# EAGLE schematic CMOS_Synthesizer_V2_REVB (EAGLE 9.6.2)

## Sheet 1 of 12: Gated Schmitt trigger Oscillator 1-4 (CD4093)
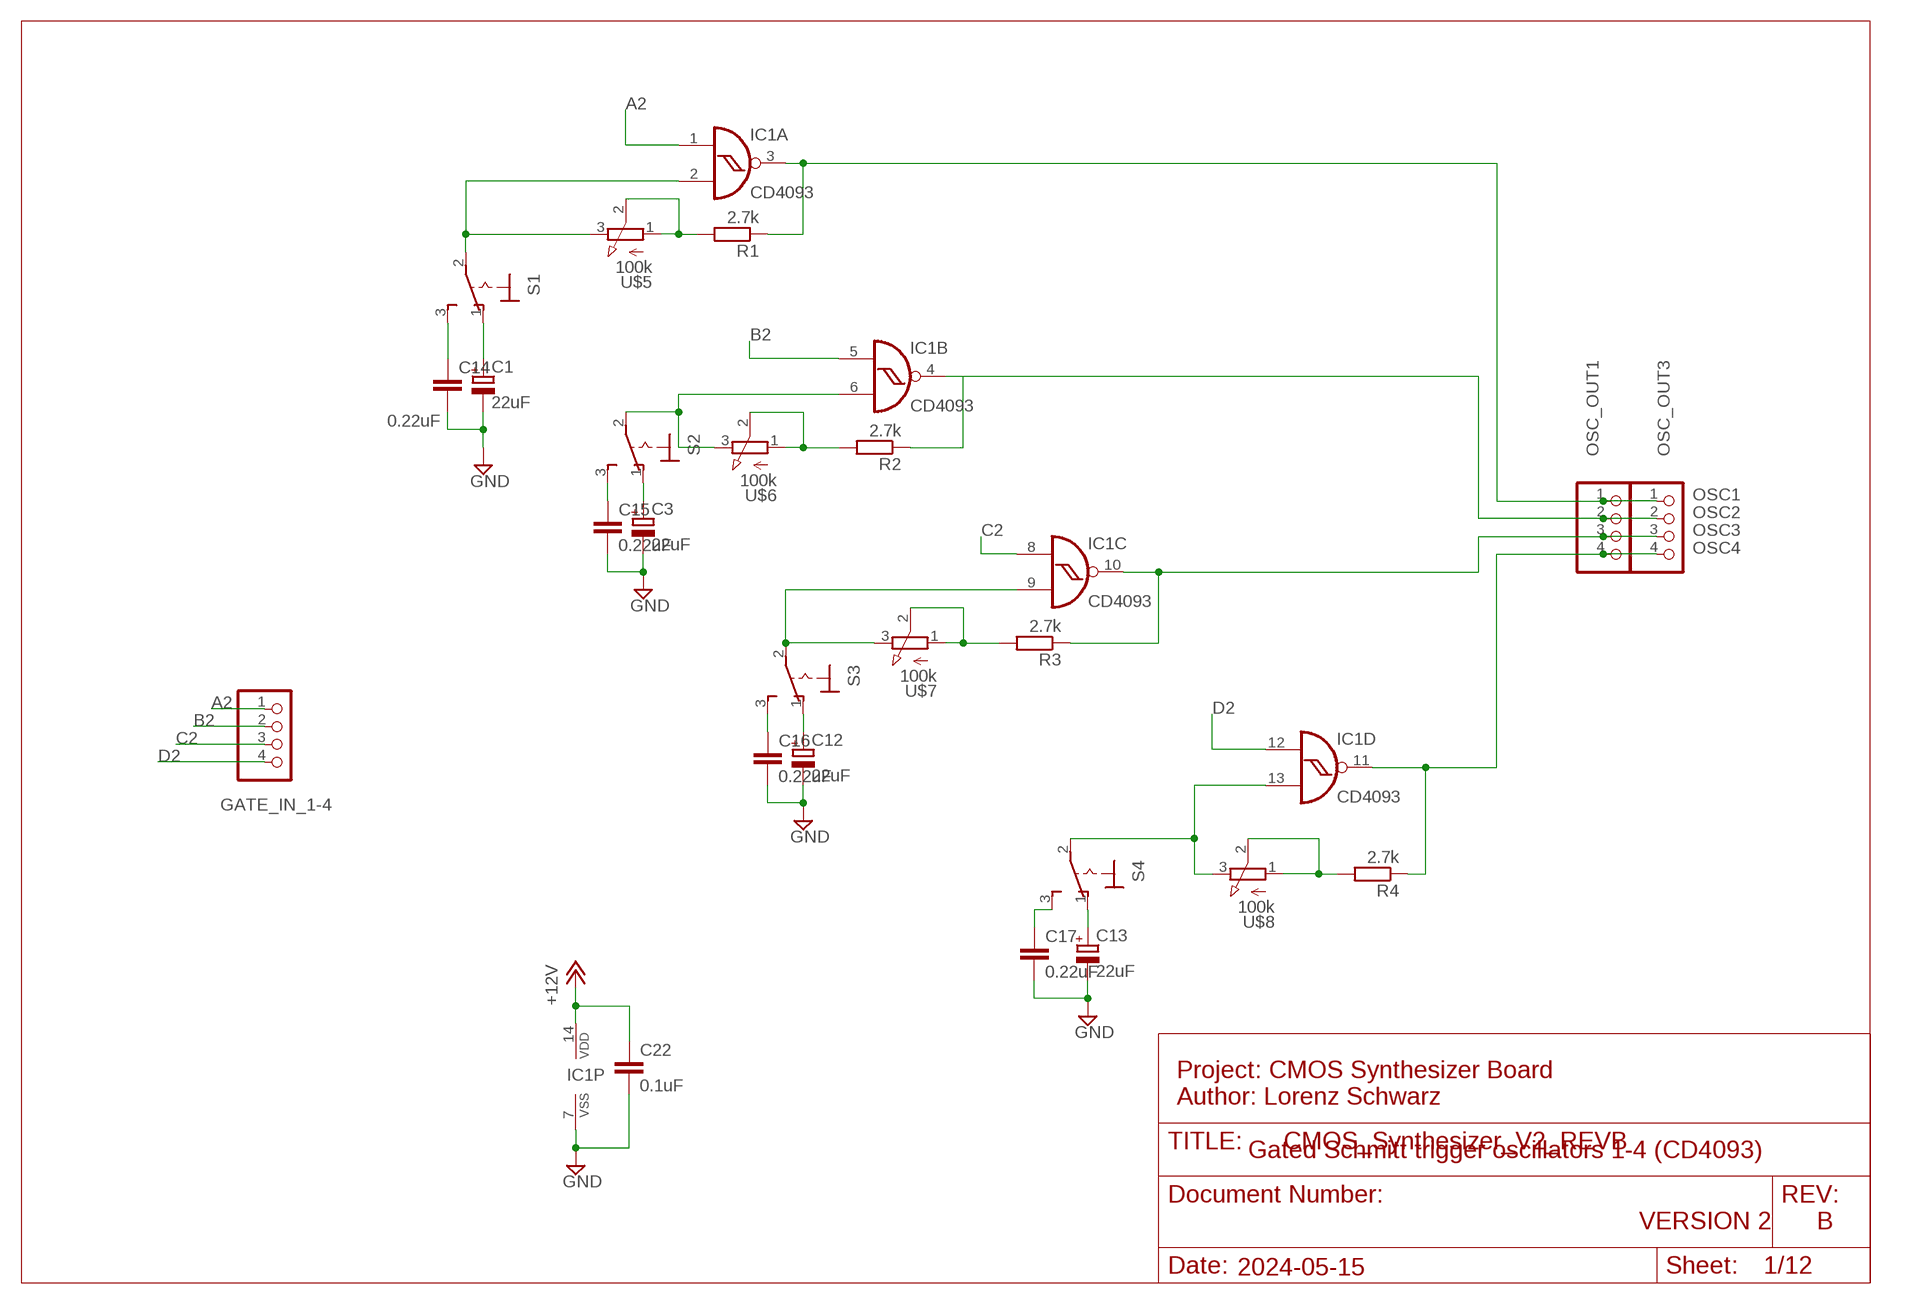
[diagram p0: schematic, sheet 1]

### Parts
C1  22uF  CPOL-EUD  [PANASONIC_D]
C3  22uF  CPOL-EUD  [PANASONIC_D]
C12  22uF  CPOL-EUD  [PANASONIC_D]
C13  22uF  CPOL-EUD  [PANASONIC_D]
C14  0.22uF  C-EUC0805  [C0805]
C15  0.22uF  C-EUC0805  [C0805]
C16  0.22uF  C-EUC0805  [C0805]
C17  0.22uF  C-EUC0805  [C0805]
C22  0.1uF  C-EUC0805  [C0805]
GATE_IN_1-4  PINHD-1X4_2.54  [1X04]
IC1  CD4093  4093N  [DIL14]
OSC_OUT1  PINHD-1X4_2.54  [1X04]
OSC_OUT3  PINHD-1X4_2.54  [1X04]
R1  2.7k  R-EU_R0805  [R0805]
R2  2.7k  R-EU_R0805  [R0805]
R3  2.7k  R-EU_R0805  [R0805]
R4  2.7k  R-EU_R0805  [R0805]
S1  M9040P  [M9040P]
S2  M9040P  [M9040P]
S3  M9040P  [M9040P]
S4  M9040P  [M9040P]
U$5  100k  POT_VERTICAL  [POT_VER]
U$6  100k  POT_VERTICAL  [POT_VER]
U$7  100k  POT_VERTICAL  [POT_VER]
U$8  100k  POT_VERTICAL  [POT_VER]

### Nets
+12V: C22.1 IC1.14(P:VDD) ; also sheet 2,3,4,5,6,7,8,9,10,11
A2: GATE_IN_1-4.1 IC1.1(A:I0)
B2: GATE_IN_1-4.2 IC1.5(B:I0)
C2: GATE_IN_1-4.3 IC1.8(C:I0)
D2: GATE_IN_1-4.4 IC1.12(D:I0)
GND: C1.- C3.- C12.- C13.- C14.2 C15.2 C16.2 C17.2 C22.2 IC1.7(P:VSS) ; also sheet 2,3,4,5,6,7,8,9,10,11,12
N$34: C1.+ S1.1(O)
N$35: IC1.2(A:I1) S1.2(P) U$5.3(E)
N$46: C3.+ S2.1(O)
N$47: C15.1 S2.3(S)
N$48: IC1.6(B:I1) S2.2(P) U$6.3(E)
N$49: C12.+ S3.1(O)
N$50: C16.1 S3.3(S)
N$51: IC1.9(C:I1) S3.2(P) U$7.3(E)
N$53: C13.+ S4.1(O)
N$123: C17.1 S4.3(S)
N$130: IC1.13(D:I1) S4.2(P) U$8.3(E)
N$133: R1.2 U$5.1(A) U$5.2(S)
N$134: R2.2 U$6.1(A) U$6.2(S)
N$135: R3.2 U$7.1(A) U$7.2(S)
N$136: R4.2 U$8.1(A) U$8.2(S)
N$137: C14.1 S1.3(S)
OSC1: IC1.3(A:O) OSC_OUT1.1 OSC_OUT3.1 R1.1 ; also sheet 12
OSC2: IC1.4(B:O) OSC_OUT1.2 OSC_OUT3.2 R2.1 ; also sheet 12
OSC3: IC1.10(C:O) OSC_OUT1.3 OSC_OUT3.3 R3.1 ; also sheet 12
OSC4: IC1.11(D:O) OSC_OUT1.4 OSC_OUT3.4 R4.1 ; also sheet 12

### Notes on the sheet
- Project: CMOS Synthesizer Board
  Author: Lorenz Schwarz
- Gated Schmitt trigger oscillators 1-4 (CD4093)
- VERSION 2 | B
- 2024-05-15

## Sheet 2 of 12: Gated Schmitt trigger Oscillator 5-8 (CD4093)
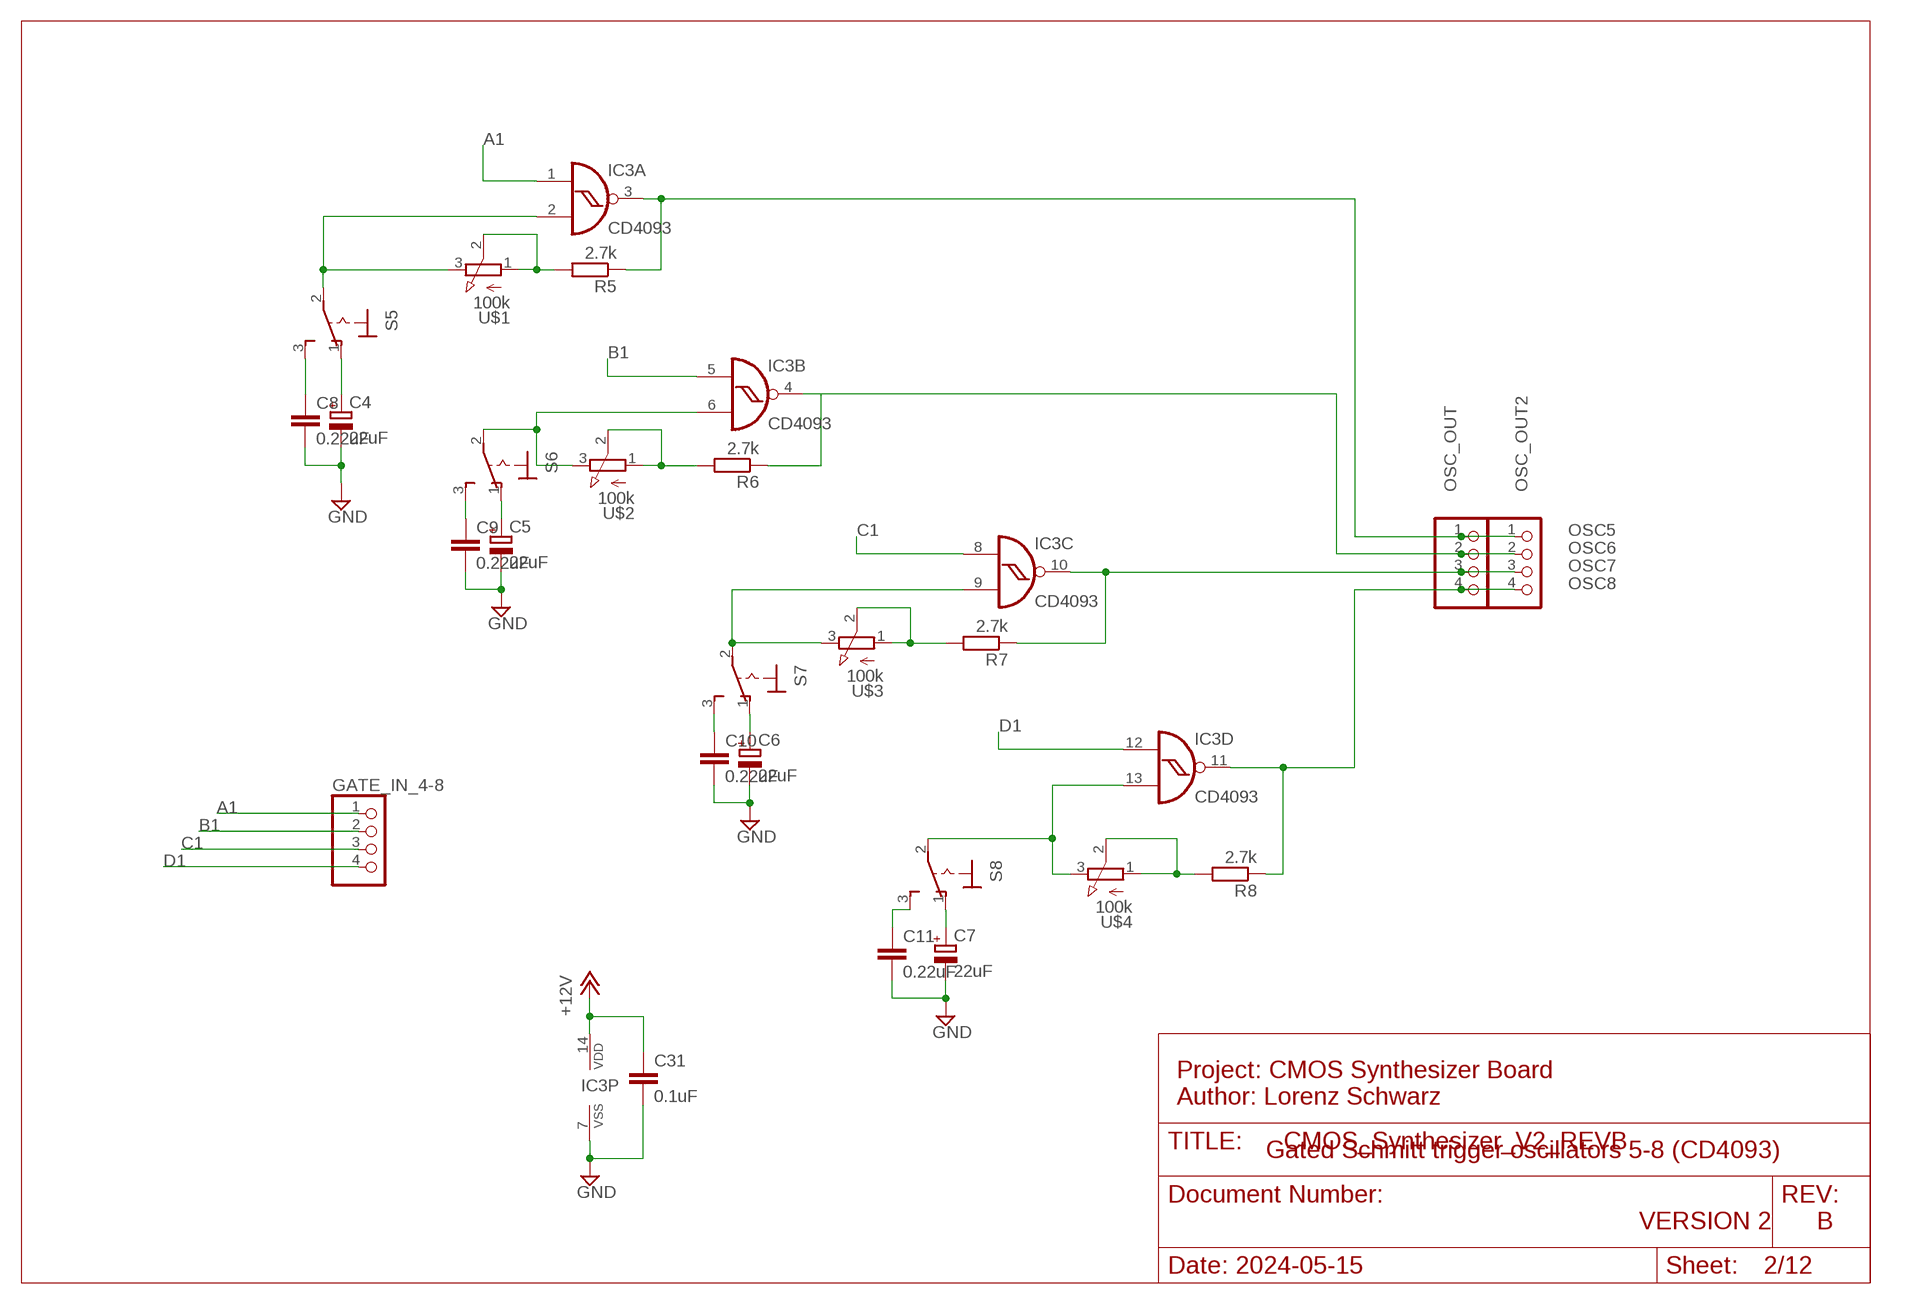
[diagram p1: schematic, sheet 2]

### Parts
C4  22uF  CPOL-EUD  [PANASONIC_D]
C5  22uF  CPOL-EUD  [PANASONIC_D]
C6  22uF  CPOL-EUD  [PANASONIC_D]
C7  22uF  CPOL-EUD  [PANASONIC_D]
C8  0.22uF  C-EUC0805  [C0805]
C9  0.22uF  C-EUC0805  [C0805]
C10  0.22uF  C-EUC0805  [C0805]
C11  0.22uF  C-EUC0805  [C0805]
C31  0.1uF  C-EUC0805  [C0805]
GATE_IN_4-8  PINHD-1X4_2.54  [1X04]
IC3  CD4093  4093N  [DIL14]
OSC_OUT  PINHD-1X4_2.54  [1X04]
OSC_OUT2  PINHD-1X4_2.54  [1X04]
R5  2.7k  R-EU_R0805  [R0805]
R6  2.7k  R-EU_R0805  [R0805]
R7  2.7k  R-EU_R0805  [R0805]
R8  2.7k  R-EU_R0805  [R0805]
S5  M9040P  [M9040P]
S6  M9040P  [M9040P]
S7  M9040P  [M9040P]
S8  M9040P  [M9040P]
U$1  100k  POT_VERTICAL  [POT_VER]
U$2  100k  POT_VERTICAL  [POT_VER]
U$3  100k  POT_VERTICAL  [POT_VER]
U$4  100k  POT_VERTICAL  [POT_VER]

### Nets
+12V: C31.1 IC3.14(P:VDD) ; also sheet 1,3,4,5,6,7,8,9,10,11
A1: GATE_IN_4-8.1 IC3.1(A:I0)
B1: GATE_IN_4-8.2 IC3.5(B:I0)
C1: GATE_IN_4-8.3 IC3.8(C:I0)
D1: GATE_IN_4-8.4 IC3.12(D:I0)
GND: C4.- C5.- C6.- C7.- C8.2 C9.2 C10.2 C11.2 C31.2 IC3.7(P:VSS) ; also sheet 1,3,4,5,6,7,8,9,10,11,12
N$1: C5.+ S6.1(O)
N$3: C9.1 S6.3(S)
N$4: C8.1 S5.3(S)
N$10: C4.+ S5.1(O)
N$11: IC3.2(A:I1) S5.2(P) U$1.3(E)
N$12: IC3.6(B:I1) S6.2(P) U$2.3(E)
N$15: C6.+ S7.1(O)
N$16: C10.1 S7.3(S)
N$17: IC3.9(C:I1) S7.2(P) U$3.3(E)
N$19: C7.+ S8.1(O)
N$20: C11.1 S8.3(S)
N$21: IC3.13(D:I1) S8.2(P) U$4.3(E)
N$24: R5.2 U$1.1(A) U$1.2(S)
N$25: R6.2 U$2.1(A) U$2.2(S)
N$26: R7.2 U$3.1(A) U$3.2(S)
N$27: R8.2 U$4.1(A) U$4.2(S)
OSC5: IC3.3(A:O) OSC_OUT2.1 OSC_OUT.1 R5.1
OSC6: IC3.4(B:O) OSC_OUT2.2 OSC_OUT.2 R6.1
OSC7: IC3.10(C:O) OSC_OUT2.3 OSC_OUT.3 R7.1
OSC8: IC3.11(D:O) OSC_OUT2.4 OSC_OUT.4 R8.1 ; also sheet 5

### Notes on the sheet
- Project: CMOS Synthesizer Board
  Author: Lorenz Schwarz
- Gated Schmitt trigger oscillators 5-8 (CD4093)
- VERSION 2 | B
- 2024-05-15

## Sheet 3 of 12: XOR-based modulators (CD4070)
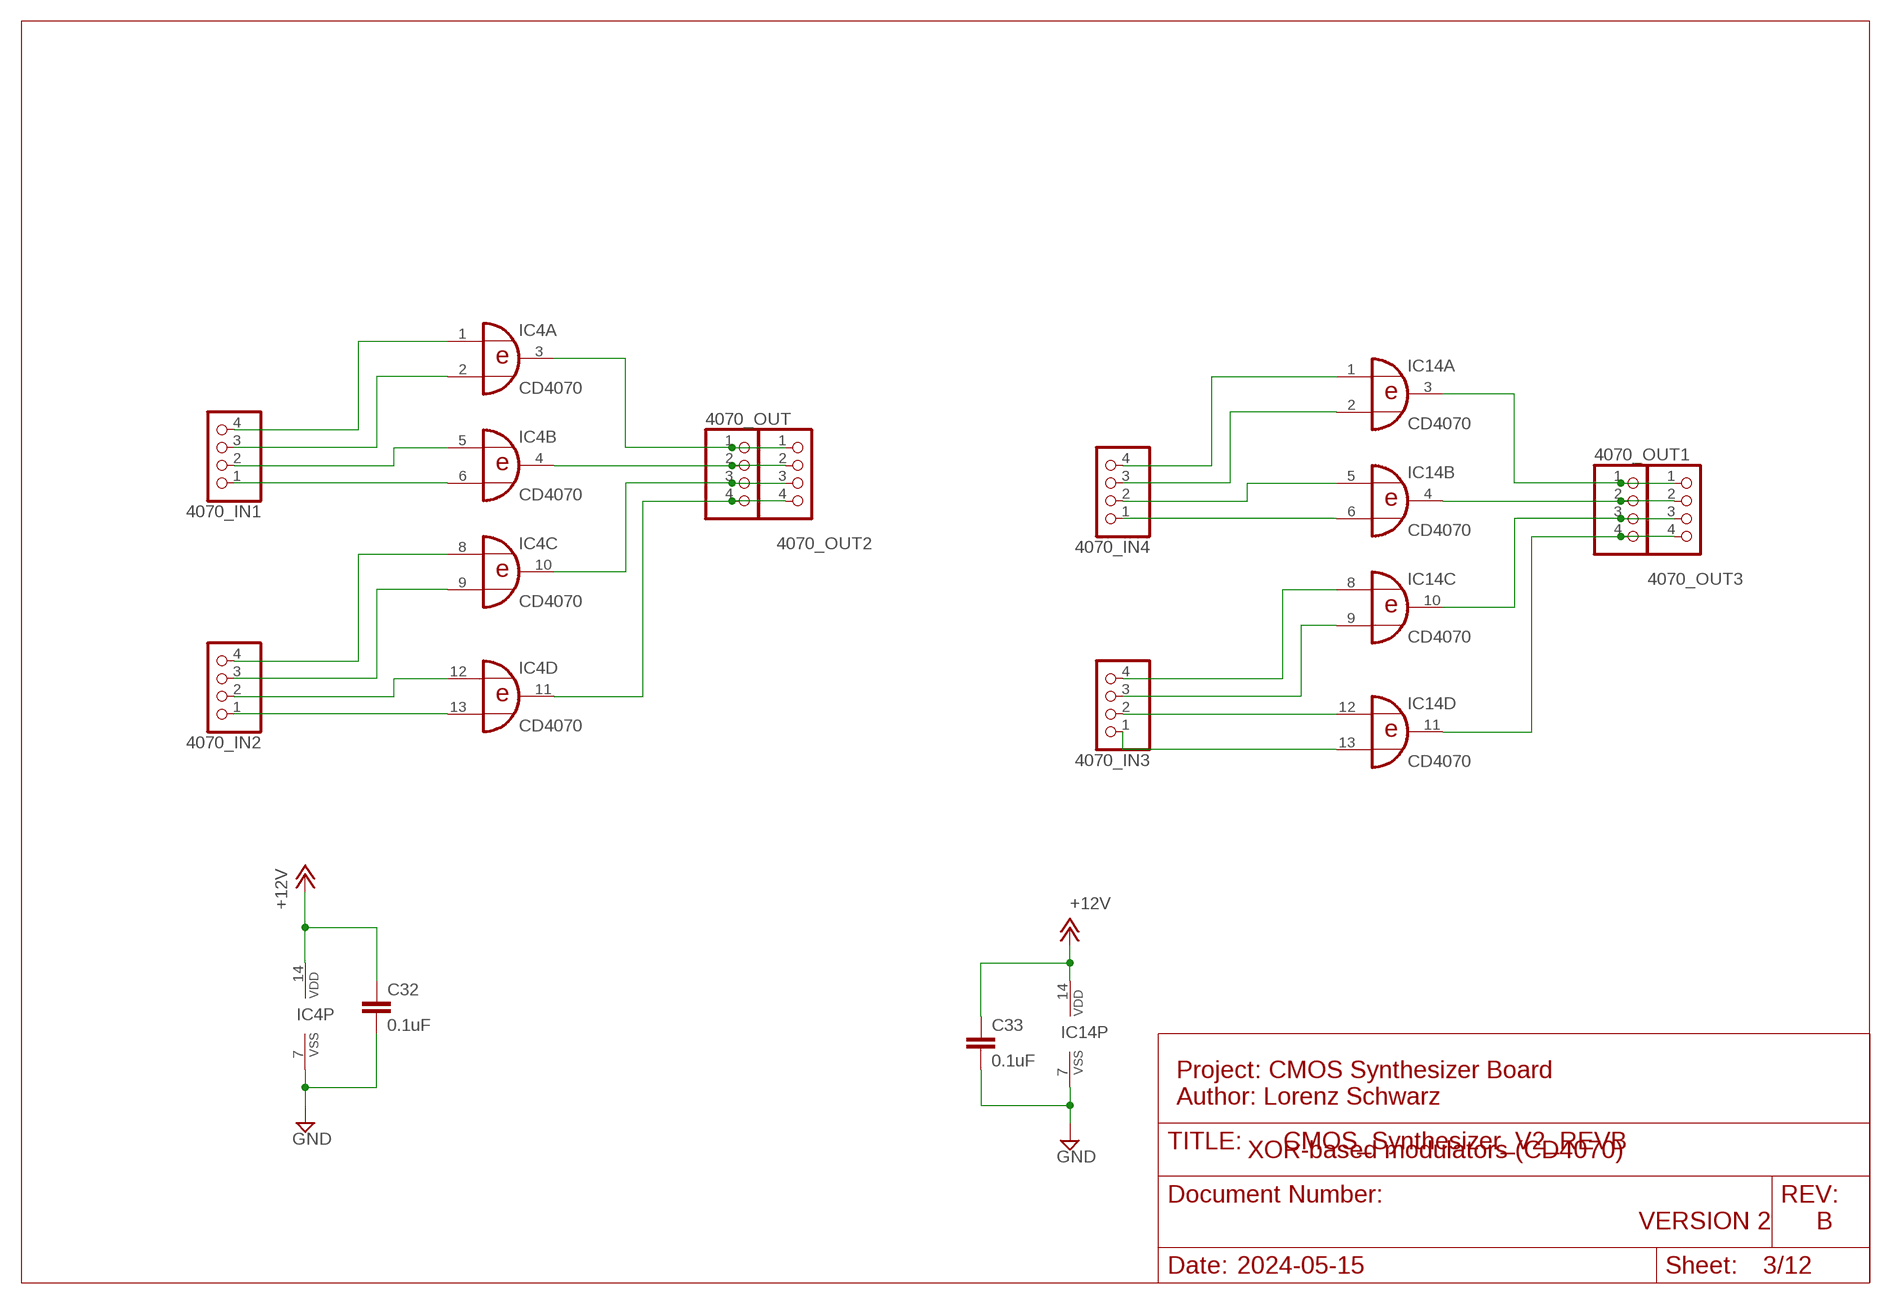
[diagram p2: schematic, sheet 3]

### Parts
4070_IN1  PINHD-1X4_2.54  [1X04]
4070_IN2  PINHD-1X4_2.54  [1X04]
4070_IN3  PINHD-1X4_2.54  [1X04]
4070_IN4  PINHD-1X4_2.54  [1X04]
4070_OUT  PINHD-1X4_2.54  [1X04]
4070_OUT1  PINHD-1X4_2.54  [1X04]
4070_OUT2  PINHD-1X4_2.54  [1X04]
4070_OUT3  PINHD-1X4_2.54  [1X04]
C32  0.1uF  C-EUC0805  [C0805]
C33  0.1uF  C-EUC0805  [C0805]
IC4  CD4070  4070N  [DIL14]
IC14  CD4070  4070N  [DIL14]

### Nets
+12V: C32.1 C33.1 IC4.14(P:VDD) IC14.14(P:VDD) ; also sheet 1,2,4,5,6,7,8,9,10,11
GND: C32.2 C33.2 IC4.7(P:VSS) IC14.7(P:VSS) ; also sheet 1,2,4,5,6,7,8,9,10,11,12
N$5: 4070_OUT2.1 4070_OUT.1 IC4.3(A:O)
N$6: 4070_OUT2.2 4070_OUT.2 IC4.4(B:O)
N$7: 4070_OUT2.3 4070_OUT.3 IC4.10(C:O)
N$8: 4070_OUT2.4 4070_OUT.4 IC4.11(D:O)
N$9: 4070_IN1.4 IC4.1(A:I0)
N$23: 4070_IN1.3 IC4.2(A:I1)
N$28: 4070_IN1.2 IC4.5(B:I0)
N$29: 4070_IN1.1 IC4.6(B:I1)
N$30: 4070_IN2.4 IC4.8(C:I0)
N$31: 4070_IN2.3 IC4.9(C:I1)
N$32: 4070_IN2.2 IC4.12(D:I0)
N$33: 4070_IN2.1 IC4.13(D:I1)
N$138: 4070_OUT1.1 4070_OUT3.1 IC14.3(A:O)
N$141: 4070_OUT1.2 4070_OUT3.2 IC14.4(B:O)
N$142: 4070_OUT1.3 4070_OUT3.3 IC14.10(C:O)
N$151: 4070_OUT1.4 4070_OUT3.4 IC14.11(D:O)
N$153: 4070_IN4.4 IC14.1(A:I0)
N$155: 4070_IN4.3 IC14.2(A:I1)
N$156: 4070_IN4.2 IC14.5(B:I0)
N$157: 4070_IN4.1 IC14.6(B:I1)
N$158: 4070_IN3.4 IC14.8(C:I0)
N$159: 4070_IN3.3 IC14.9(C:I1)
N$160: 4070_IN3.2 IC14.12(D:I0)
N$161: 4070_IN3.1 IC14.13(D:I1)

### Notes on the sheet
- Project: CMOS Synthesizer Board
  Author: Lorenz Schwarz
- XOR-based modulators (CD4070)
- VERSION 2 | B
- 2024-05-15

## Sheet 4 of 12: Switches / Multiplexers (CD405x)
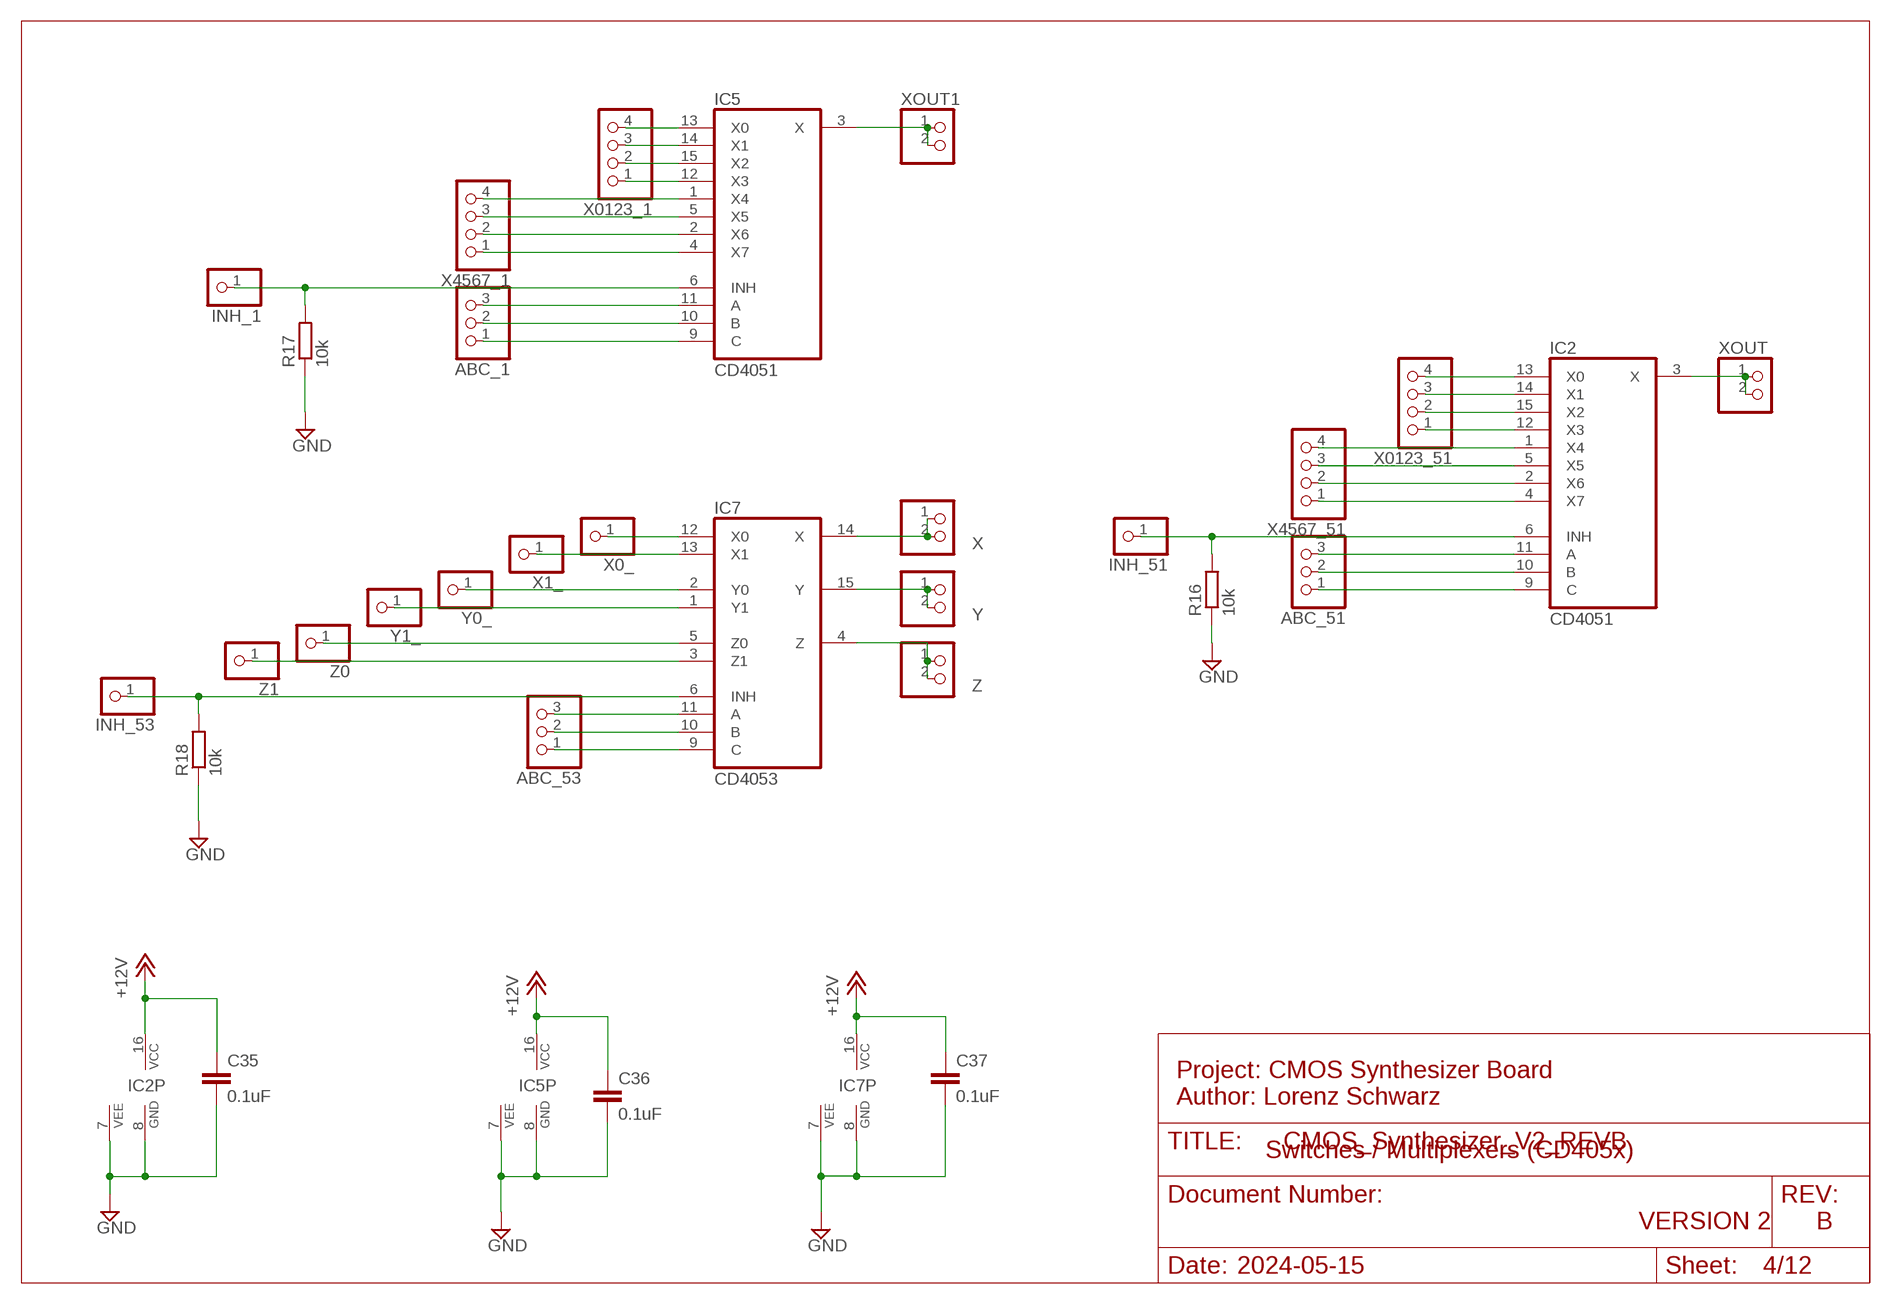
[diagram p3: schematic, sheet 4]

### Parts
ABC_1  PINHD-1X3  [1X03]
ABC_51  PINHD-1X3  [1X03]
ABC_53  PINHD-1X3  [1X03]
C35  0.1uF  C-EUC0805  [C0805]
C36  0.1uF  C-EUC0805  [C0805]
C37  0.1uF  C-EUC0805  [C0805]
IC2  CD4051  4051N  [DIL16]
IC5  CD4051  4051N  [DIL16]
IC7  CD4053  4053N  [DIL16]
INH_1  PINHD-1X1  [1X01]
INH_51  PINHD-1X1  [1X01]
INH_53  PINHD-1X1  [1X01]
R16  10k  R-EU_R0805  [R0805]
R17  10k  R-EU_R0805  [R0805]
R18  10k  R-EU_R0805  [R0805]
X  PINHD-1X2  [1X02]
X0_  PINHD-1X1  [1X01]
X1_  PINHD-1X1  [1X01]
X0123_1  PINHD-1X4_2.54  [1X04]
X0123_51  PINHD-1X4_2.54  [1X04]
X4567_1  PINHD-1X4_2.54  [1X04]
X4567_51  PINHD-1X4_2.54  [1X04]
XOUT  PINHD-1X2  [1X02]
XOUT1  PINHD-1X2  [1X02]
Y  PINHD-1X2  [1X02]
Y0_  PINHD-1X1  [1X01]
Y1_  PINHD-1X1  [1X01]
Z  PINHD-1X2  [1X02]
Z0  PINHD-1X1  [1X01]
Z1  PINHD-1X1  [1X01]

### Nets
+12V: C35.1 C36.1 C37.1 IC2.16(VCC) IC5.16(VCC) IC7.16(VCC) ; also sheet 1,2,3,5,6,7,8,9,10,11
GND: C35.2 C36.2 C37.2 IC2.7(VEE) IC2.8(GND) IC5.7(VEE) IC5.8(GND) IC7.7(VEE) IC7.8(GND) R16.1 R17.1 R18.1 ; also sheet 1,2,3,5,6,7,8,9,10,11,12
N$18: IC5.12(X3) X0123_1.1
N$22: IC5.15(X2) X0123_1.2
N$36: IC5.14(X1) X0123_1.3
N$37: IC5.13(X0) X0123_1.4
N$38: IC7.4(Z) Z.1 Z.2
N$39: IC7.15(Y) Y.1 Y.2
N$40: IC7.14(X) X.1 X.2
N$41: IC7.6(INH) INH_53.1 R18.2
N$42: ABC_53.1 IC7.9(C)
N$43: ABC_53.2 IC7.10(B)
N$44: ABC_53.3 IC7.11(A)
N$45: IC7.13(X1) X1_.1
N$52: IC5.4(X7) X4567_1.1
N$54: IC7.12(X0) X0_.1
N$55: IC7.1(Y1) Y1_.1
N$56: IC7.2(Y0) Y0_.1
N$57: IC7.3(Z1) Z1.1
N$58: IC7.5(Z0) Z0.1
N$59: IC5.2(X6) X4567_1.2
N$60: IC5.5(X5) X4567_1.3
N$61: IC5.1(X4) X4567_1.4
N$62: IC5.6(INH) INH_1.1 R17.2
N$63: ABC_1.1 IC5.9(C)
N$64: ABC_1.2 IC5.10(B)
N$65: ABC_1.3 IC5.11(A)
N$66: IC5.3(X) XOUT1.1 XOUT1.2
N$68: IC2.12(X3) X0123_51.1
N$69: IC2.15(X2) X0123_51.2
N$70: IC2.14(X1) X0123_51.3
N$71: IC2.13(X0) X0123_51.4
N$72: IC2.4(X7) X4567_51.1
N$73: IC2.2(X6) X4567_51.2
N$74: IC2.5(X5) X4567_51.3
N$75: IC2.1(X4) X4567_51.4
N$76: IC2.6(INH) INH_51.1 R16.2
N$77: ABC_51.1 IC2.9(C)
N$78: ABC_51.2 IC2.10(B)
N$79: ABC_51.3 IC2.11(A)
N$80: IC2.3(X) XOUT.1 XOUT.2

### Notes on the sheet
- Project: CMOS Synthesizer Board
  Author: Lorenz Schwarz
- Switches / Multiplexers (CD405x)
- VERSION 2 | B
- 2024-05-15

## Sheet 5 of 12: Counters / Binary Number Generators (CD4024)
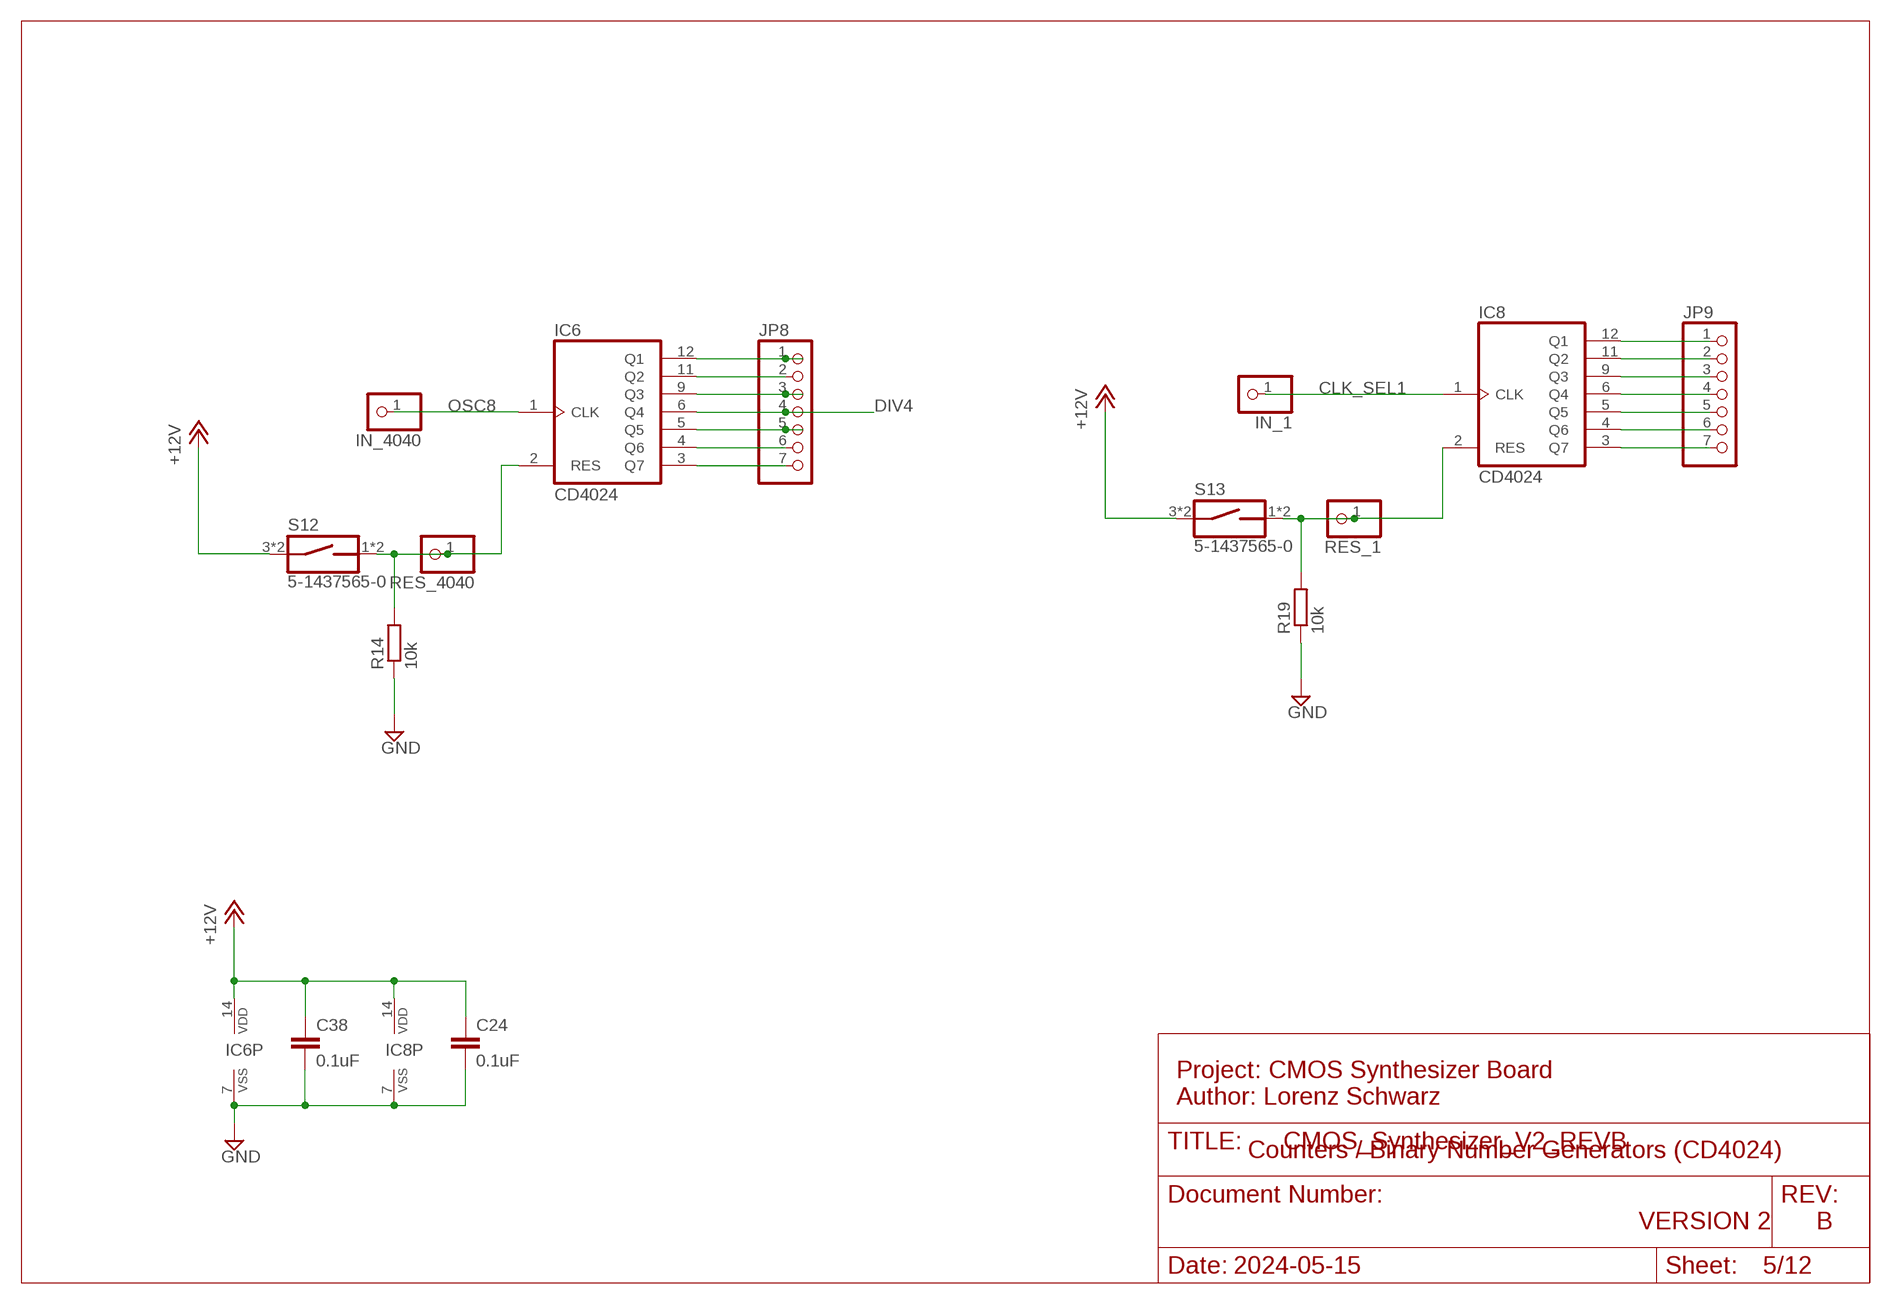
[diagram p4: schematic, sheet 5]

### Parts
C24  0.1uF  C-EUC0805  [C0805]
C38  0.1uF  C-EUC0805  [C0805]
IC6  CD4024  4024N  [DIL14]
IC8  CD4024  4024N  [DIL14]
IN_1  PINHD-1X1  [1X01]
IN_4040  PINHD-1X1  [1X01]
JP8  PINHD-1X7  [1X07]
JP9  PINHD-1X7  [1X07]
R14  10k  R-EU_R0805  [R0805]
R19  10k  R-EU_R0805  [R0805]
RES_1  PINHD-1X1  [1X01]
RES_4040  PINHD-1X1  [1X01]
S12  5-1437565-0  [SW_5-1437565-0]
S13  5-1437565-0  [SW_5-1437565-0]

### Nets
+12V: C24.1 C38.1 IC6.14(VDD) IC8.14(VDD) S12.3 S12.4 S13.3 S13.4 ; also sheet 1,2,3,4,6,7,8,9,10,11
CLK_SEL1: IC8.1(CLK) IN_1.1 ; also sheet 10,12
DIV4: IC6.6(Q4) JP8.4 ; also sheet 12
GND: C24.2 C38.2 IC6.7(VSS) IC8.7(VSS) R14.1 R19.1 ; also sheet 1,2,3,4,6,7,8,9,10,11,12
N$81: IC6.11(Q2) JP8.2
N$82: IC8.12(Q1) JP9.1
N$83: IC8.11(Q2) JP9.2
N$84: IC8.9(Q3) JP9.3
N$85: IC6.4(Q6) JP8.6
N$98: IC6.12(Q1) JP8.1
N$100: IC6.9(Q3) JP8.3
N$102: IC6.5(Q5) JP8.5
N$104: IC6.3(Q7) JP8.7
N$109: IC8.6(Q4) JP9.4
N$110: IC6.2(RES) R14.2 RES_4040.1 S12.1 S12.2
N$132: IC8.5(Q5) JP9.5
N$139: IC8.4(Q6) JP9.6
N$140: IC8.3(Q7) JP9.7
N$146: IC8.2(RES) R19.2 RES_1.1 S13.1 S13.2
OSC8: IC6.1(CLK) IN_4040.1 ; also sheet 2

### Notes on the sheet
- Project: CMOS Synthesizer Board
  Author: Lorenz Schwarz
- Counters / Binary Number Generators (CD4024)
- VERSION 2 | B
- 2024-05-15

## Sheet 6 of 12: Power Input
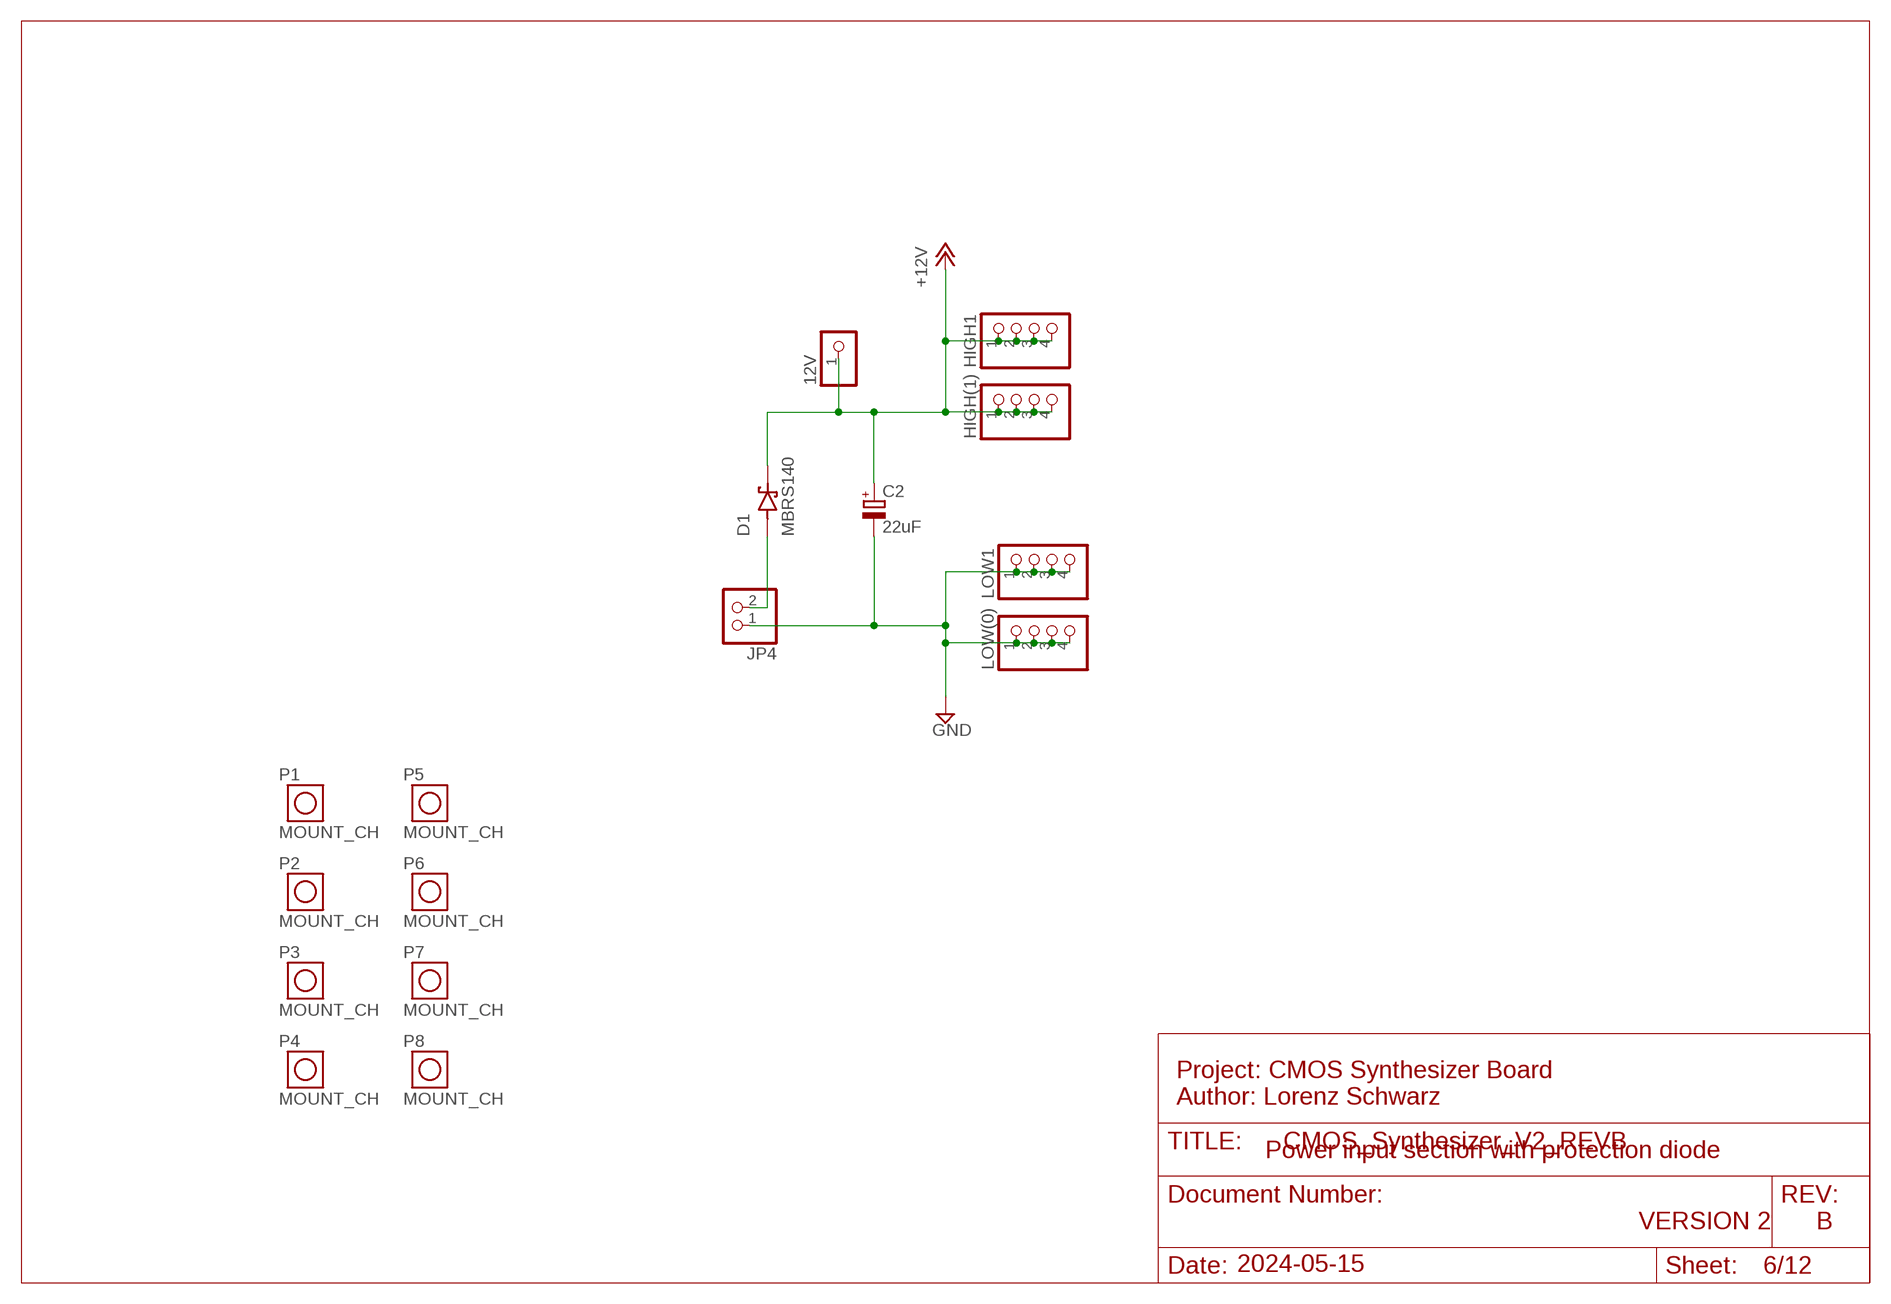
[diagram p5: schematic, sheet 6]

### Parts
12V  PINHD-1X1  [1X01]
C2  22uF  CPOL-EUD  [PANASONIC_D]
D1  MBRS140  [DIO_MBRS140]
HIGH1  PINHD-1X4  [1X04]
HIGH(1)  PINHD-1X4  [1X04]
JP4  PINHD-1X2_2.54  [1X02]
LOW1  PINHD-1X4  [1X04]
LOW(0)  PINHD-1X4  [1X04]
P1  MOUNT_CH  [MOUNT_CH32]
P2  MOUNT_CH  [MOUNT_CH32]
P3  MOUNT_CH  [MOUNT_CH32]
P4  MOUNT_CH  [MOUNT_CH32]
P5  MOUNT_CH  [MOUNT_CH32]
P6  MOUNT_CH  [MOUNT_CH32]
P7  MOUNT_CH  [MOUNT_CH32]
P8  MOUNT_CH  [MOUNT_CH32]

### Nets
+12V: 12V.1 C2.+ D1.C(K) HIGH1.1 HIGH1.2 HIGH1.3 HIGH1.4 HIGH(1).1 HIGH(1).2 HIGH(1).3 HIGH(1).4 ; also sheet 1,2,3,4,5,7,8,9,10,11
GND: C2.- JP4.1 LOW1.1 LOW1.2 LOW1.3 LOW1.4 LOW(0).1 LOW(0).2 LOW(0).3 LOW(0).4 ; also sheet 1,2,3,4,5,7,8,9,10,11,12
N$2: D1.A JP4.2
Unconnected: P1.P$1 P2.P$1 P3.P$1 P4.P$1 P5.P$1 P6.P$1 P7.P$1 P8.P$1

### Notes on the sheet
- Project: CMOS Synthesizer Board
  Author: Lorenz Schwarz
- Power input section with protection diode
- VERSION 2 | B
- 2024-05-15

## Sheet 7 of 12: Counter / step sequencer (CD4022)
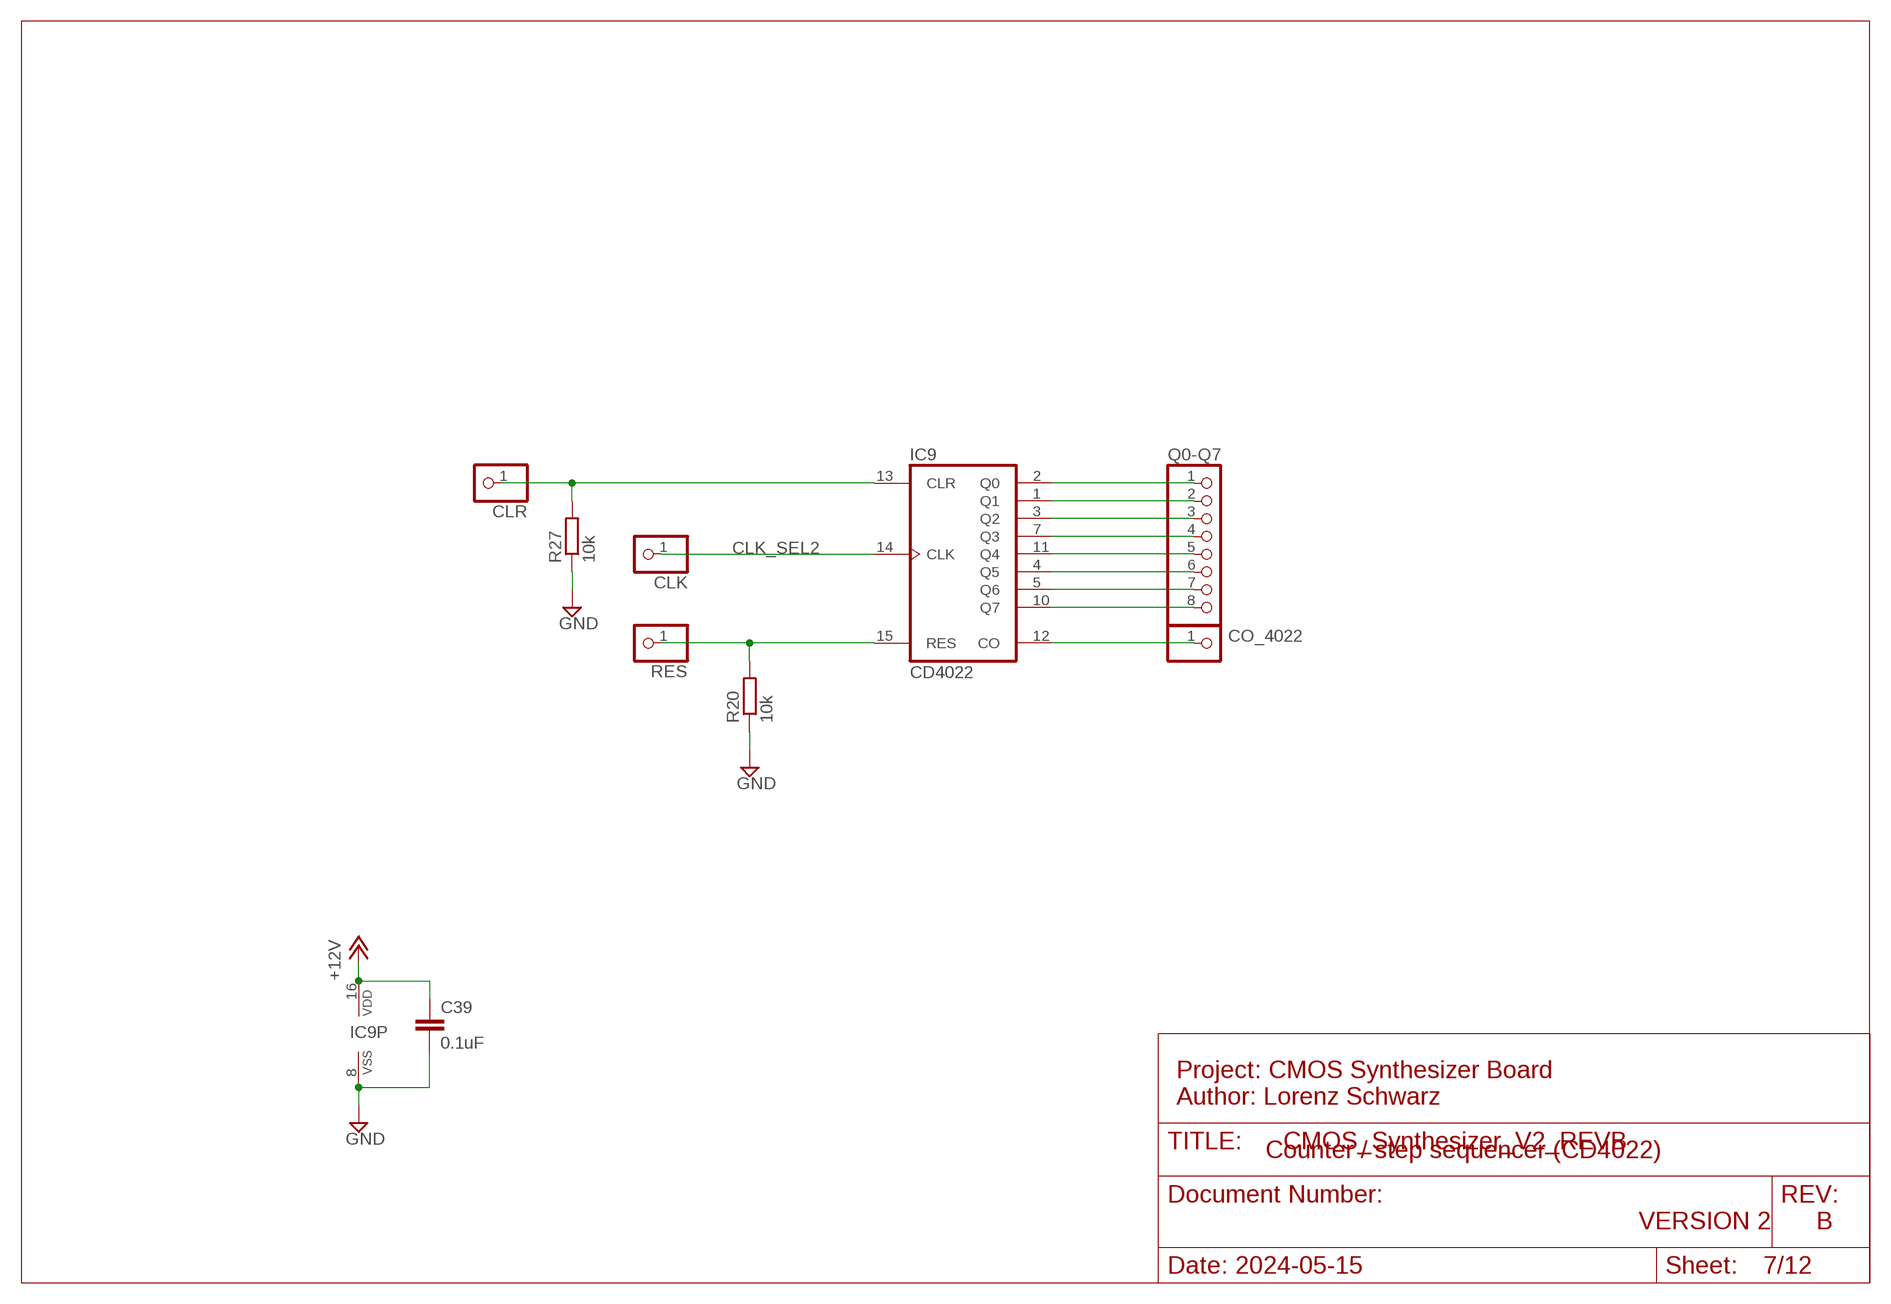
[diagram p6: schematic, sheet 7]

### Parts
C39  0.1uF  C-EUC0805  [C0805]
CLK  PINHD-1X1  [1X01]
CLR  PINHD-1X1  [1X01]
CO_4022  PINHD-1X1  [1X01]
IC9  CD4022  4022N  [DIL16]
Q0-Q7  PINHD-1X8_2.54  [1X08]
R20  10k  R-EU_R0805  [R0805]
R27  10k  R-EU_R0805  [R0805]
RES  PINHD-1X1  [1X01]

### Nets
+12V: C39.1 IC9.16(VDD) ; also sheet 1,2,3,4,5,6,8,9,10,11
CLK_SEL2: CLK.1 IC9.14(CLK) ; also sheet 12
GND: C39.2 IC9.8(VSS) R20.1 R27.1 ; also sheet 1,2,3,4,5,6,8,9,10,11,12
N$86: IC9.2(Q0) Q0-Q7.1
N$87: IC9.1(Q1) Q0-Q7.2
N$88: IC9.3(Q2) Q0-Q7.3
N$89: IC9.7(Q3) Q0-Q7.4
N$90: IC9.11(Q4) Q0-Q7.5
N$91: IC9.4(Q5) Q0-Q7.6
N$92: IC9.5(Q6) Q0-Q7.7
N$93: IC9.10(Q7) Q0-Q7.8
N$94: CO_4022.1 IC9.12(CO)
N$95: IC9.15(RES) R20.2 RES.1
N$97: CLR.1 IC9.13(CLR) R27.2

### Notes on the sheet
- Project: CMOS Synthesizer Board
  Author: Lorenz Schwarz
- Counter / step sequencer (CD4022)
- VERSION 2 | B
- 2024-05-15

## Sheet 8 of 12: Divide by-N (CD4018, CD4011)
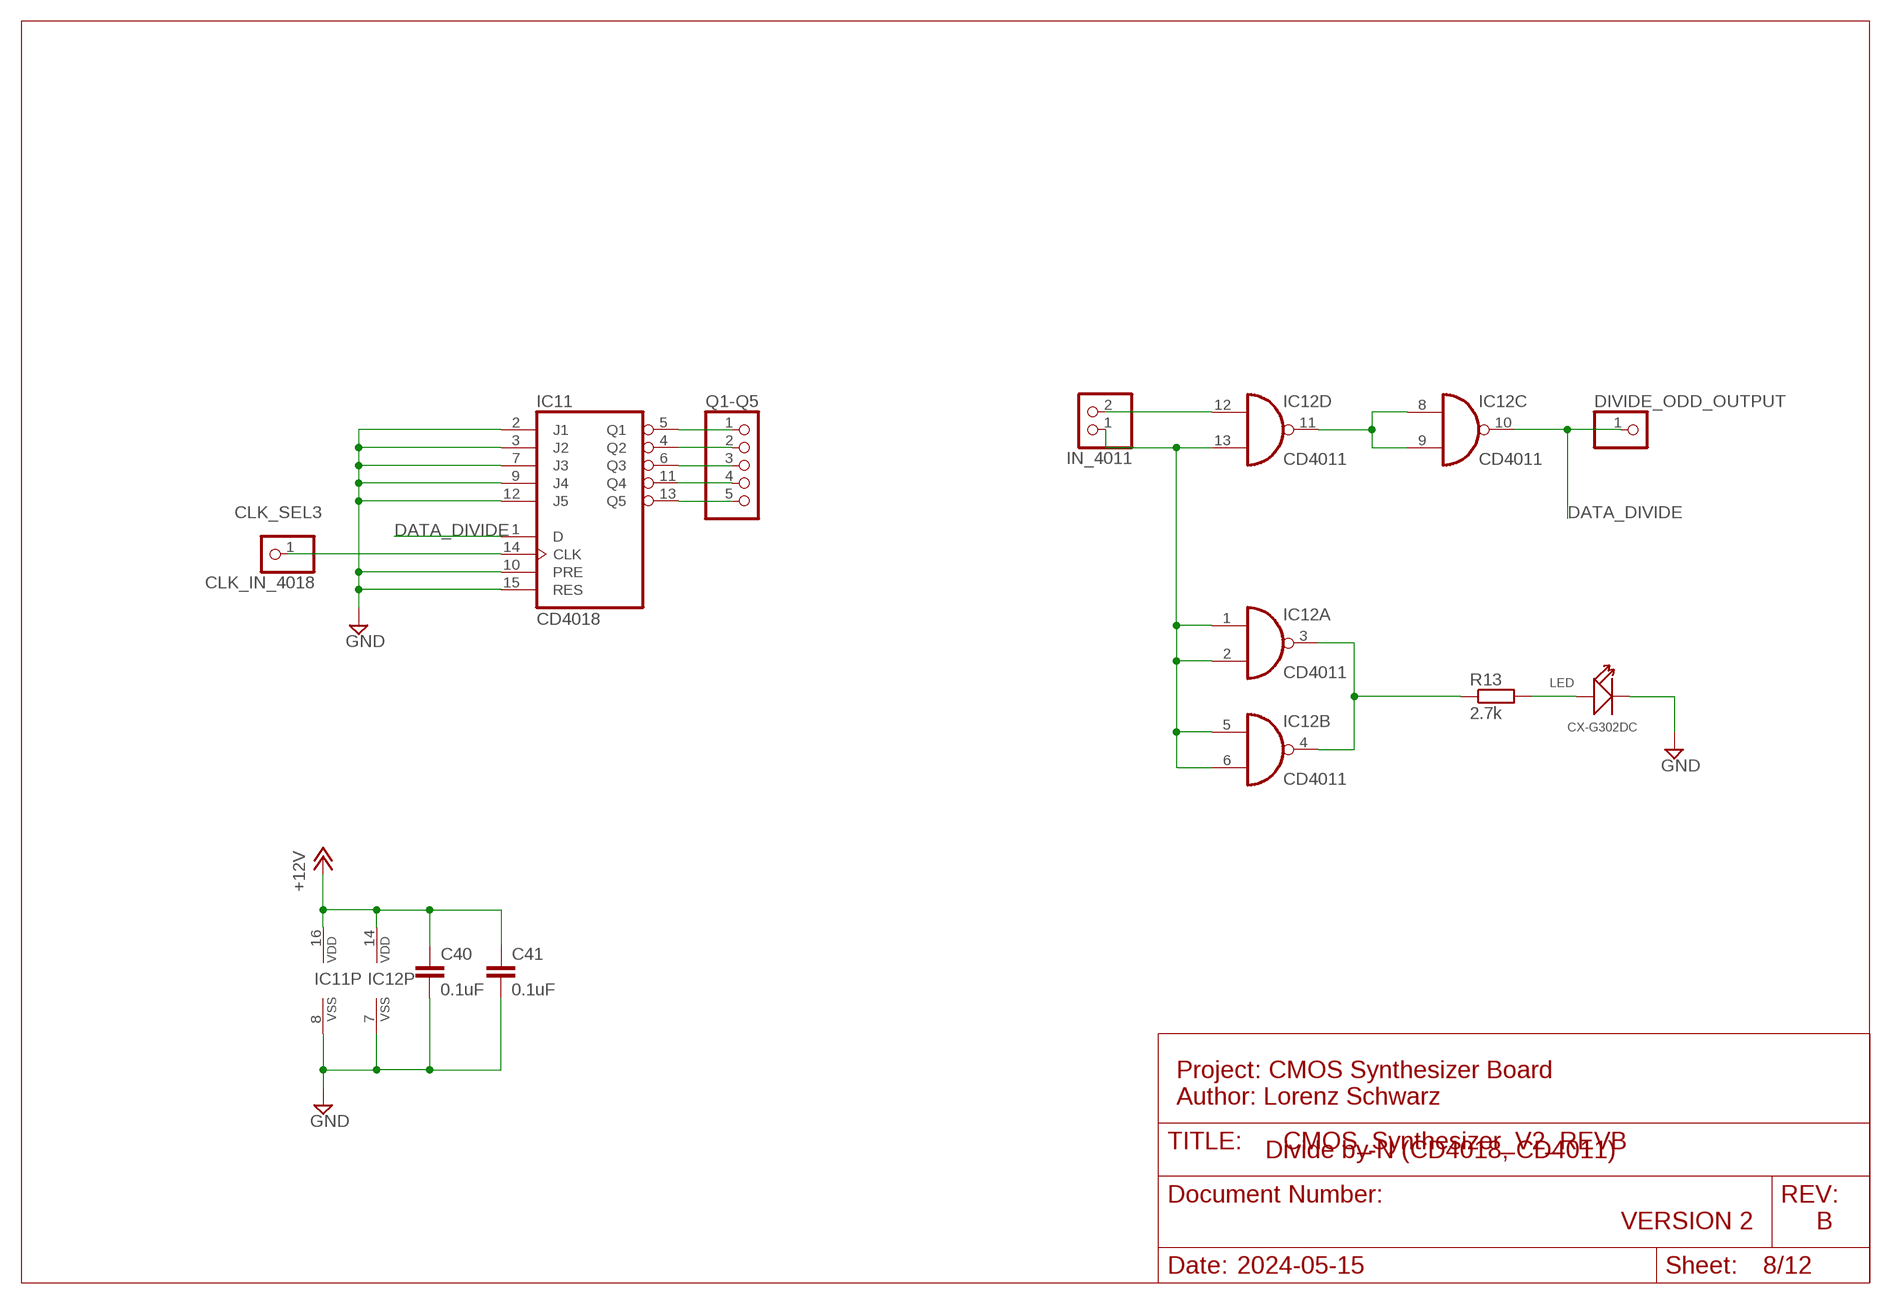
[diagram p7: schematic, sheet 8]

### Parts
C40  0.1uF  C-EUC0805  [C0805]
C41  0.1uF  C-EUC0805  [C0805]
CLK_IN_4018  PINHD-1X1  [1X01]
DIVIDE_ODD_OUTPUT  PINHD-1X1  [1X01]
IC11  CD4018  4018N  [DIL16]
IC12  CD4011  4011N  [DIL14]
IN_4011  PINHD-1X2  [1X02]
LED  CX-G302DC  DIP-LED-GREEN-GREEN(2P-D3MM)  [LED2-2.54-D3.0MM]
Q1-Q5  PINHD-1X5  [1X05]
R13  2.7k  R-EU_R0805  [R0805]

### Nets
+12V: C40.1 C41.1 IC11.16(VDD) IC12.14(P:VDD) ; also sheet 1,2,3,4,5,6,7,9,10,11
CLK_SEL3: CLK_IN_4018.1 IC11.14(CLK) ; also sheet 12
DATA_DIVIDE: DIVIDE_ODD_OUTPUT.1 IC11.1(D) IC12.10(C:O)
GND: C40.2 C41.2 IC11.2(J1) IC11.3(J2) IC11.7(J3) IC11.8(VSS) IC11.9(J4) IC11.10(PRE) IC11.12(J5) IC11.15(RES) IC12.7(P:VSS) LED.K(-) ; also sheet 1,2,3,4,5,6,7,9,10,11,12
N$120: IC12.8(C:I0) IC12.9(C:I1) IC12.11(D:O)
N$121: IC12.3(A:O) IC12.4(B:O) R13.1
N$122: IC12.12(D:I0) IN_4011.2
N$124: LED.A(+) R13.2
N$125: IC11.5(Q1) Q1-Q5.1
N$126: IC11.4(Q2) Q1-Q5.2
N$127: IC11.6(Q3) Q1-Q5.3
N$128: IC11.11(Q4) Q1-Q5.4
N$129: IC11.13(Q5) Q1-Q5.5
N$131: IC12.1(A:I0) IC12.2(A:I1) IC12.5(B:I0) IC12.6(B:I1) IC12.13(D:I1) IN_4011.1

### Notes on the sheet
- Project: CMOS Synthesizer Board
  Author: Lorenz Schwarz
- Divide by-N (CD4018, CD4011)
- VERSION 2 | B
- 2024-05-15

## Sheet 9 of 12: Schmitt trigger oscillators 9-12 and clock (CD40106)
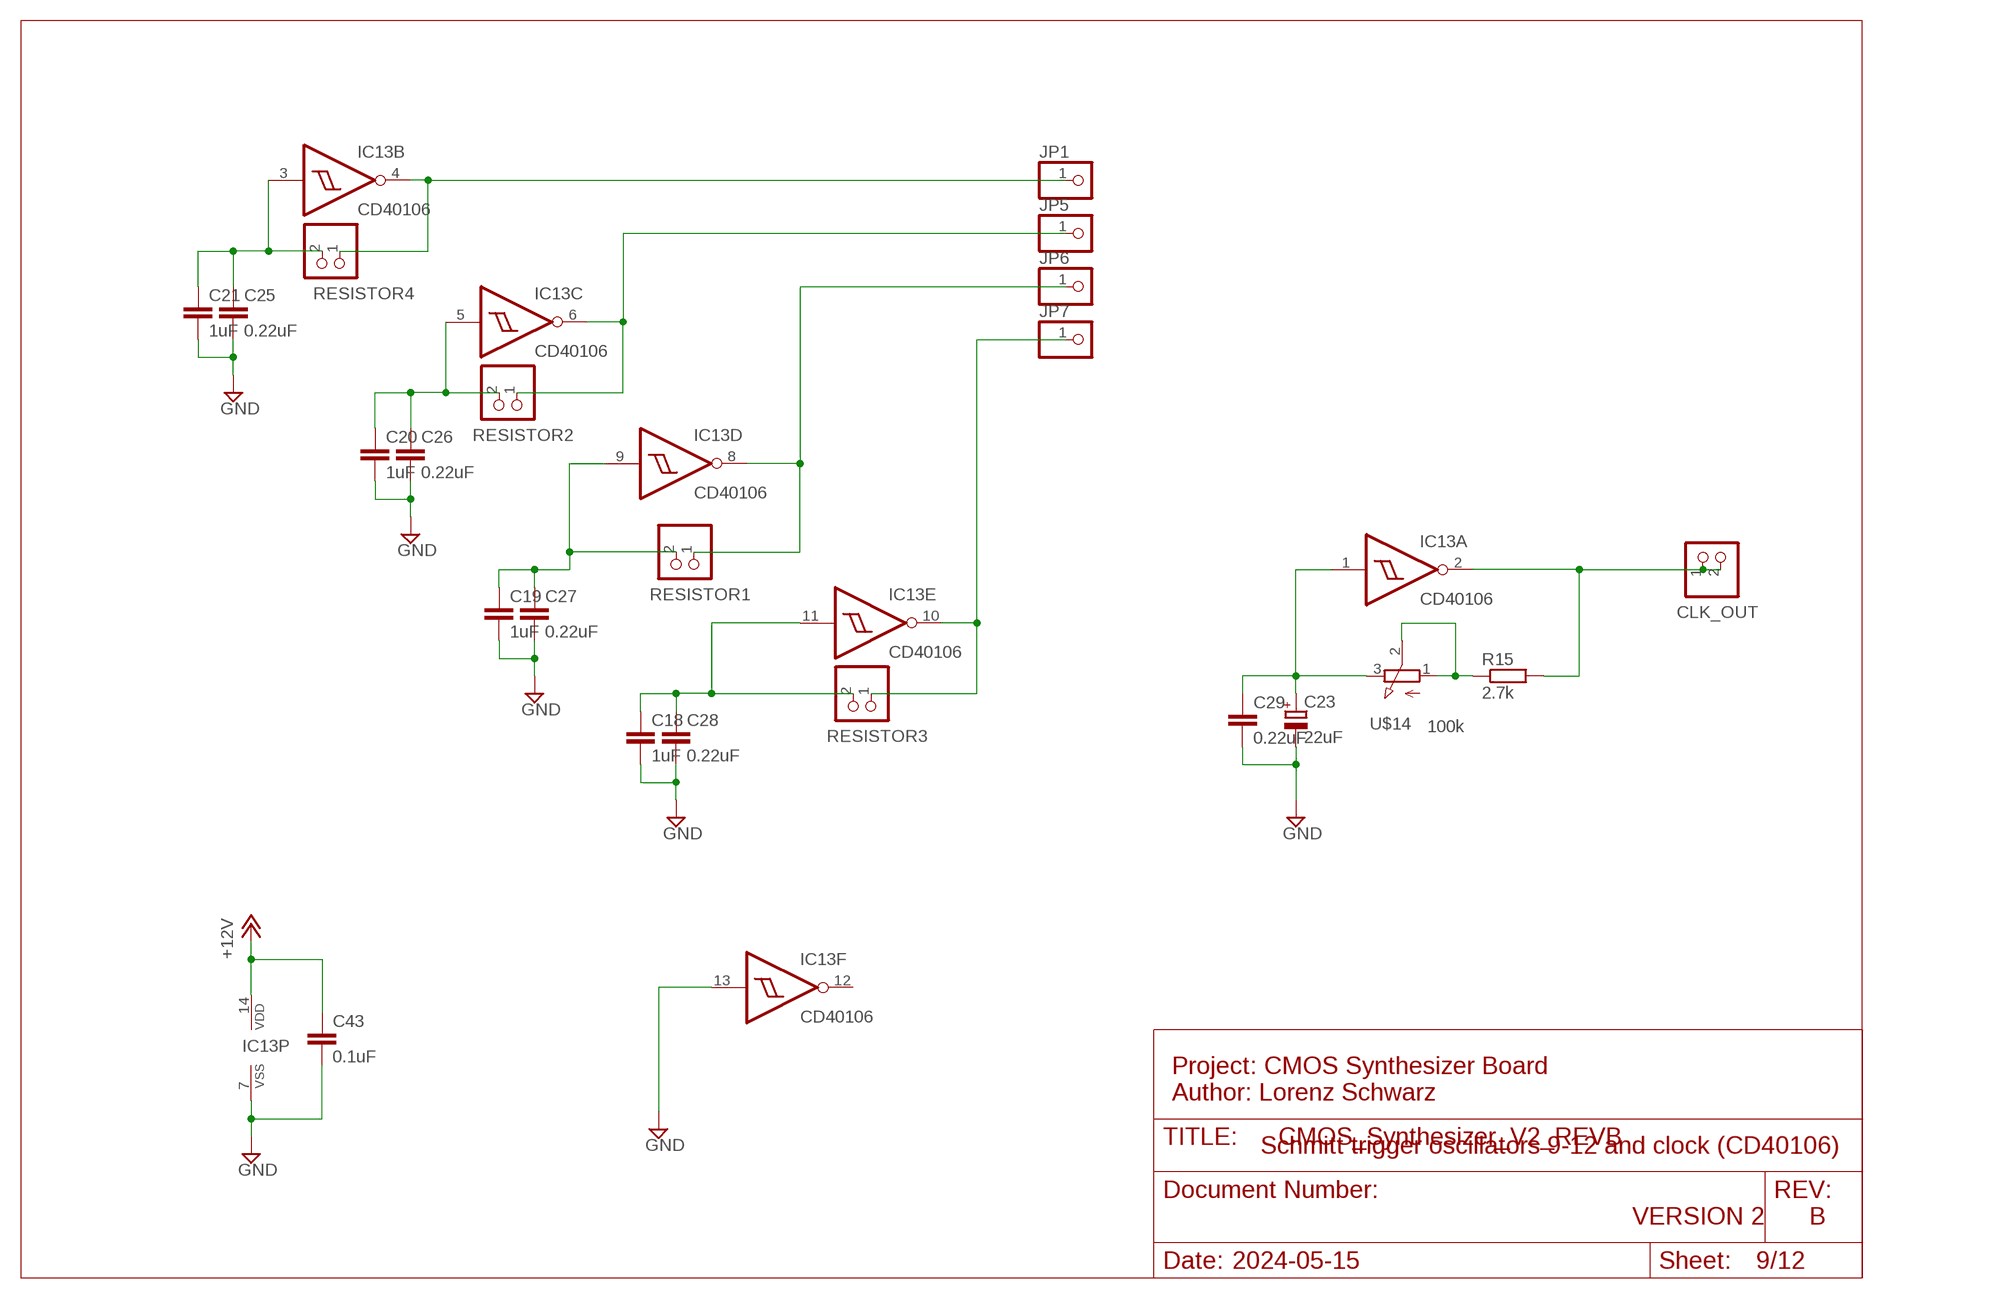
[diagram p8: schematic, sheet 9]

### Parts
C18  1uF  C-EUC0805  [C0805]
C19  1uF  C-EUC0805  [C0805]
C20  1uF  C-EUC0805  [C0805]
C21  1uF  C-EUC0805  [C0805]
C23  22uF  CPOL-EUD  [PANASONIC_D]
C25  0.22uF  C-EUC0805  [C0805]
C26  0.22uF  C-EUC0805  [C0805]
C27  0.22uF  C-EUC0805  [C0805]
C28  0.22uF  C-EUC0805  [C0805]
C29  0.22uF  C-EUC0805  [C0805]
C43  0.1uF  C-EUC0805  [C0805]
CLK_OUT  PINHD-1X2  [1X02]
IC13  CD40106  40106N  [DIL14]
JP1  PINHD-1X1  [1X01]
JP5  PINHD-1X1  [1X01]
JP6  PINHD-1X1  [1X01]
JP7  PINHD-1X1  [1X01]
R15  2.7k  R-EU_R0805  [R0805]
RESISTOR1  PINHD-1X2  [1X02]
RESISTOR2  PINHD-1X2  [1X02]
RESISTOR3  PINHD-1X2  [1X02]
RESISTOR4  PINHD-1X2  [1X02]
U$14  100k  POT_VERTICAL  [POT_VER]

### Nets
+12V: C43.1 IC13.14(P:VDD) ; also sheet 1,2,3,4,5,6,7,8,10,11
GND: C18.2 C19.2 C20.2 C21.2 C23.- C25.2 C26.2 C27.2 C28.2 C29.2 C43.2 IC13.7(P:VSS) IC13.13(F:I) ; also sheet 1,2,3,4,5,6,7,8,10,11,12
LDR1: IC13.8(D:O) JP6.1 RESISTOR1.1
LDR2: IC13.6(C:O) JP5.1 RESISTOR2.1
LDR3: IC13.10(E:O) JP7.1 RESISTOR3.1
LDR4: IC13.4(B:O) JP1.1 RESISTOR4.1
LFO: CLK_OUT.1 CLK_OUT.2 IC13.2(A:O) R15.2 ; also sheet 12
N$13: C23.+ C29.1 IC13.1(A:I) U$14.3(E)
N$14: R15.1 U$14.1(A) U$14.2(S)
N$149: C21.1 C25.1 IC13.3(B:I) RESISTOR4.2
N$150: C20.1 C26.1 IC13.5(C:I) RESISTOR2.2
N$152: C19.1 C27.1 IC13.9(D:I) RESISTOR1.2
N$154: C18.1 C28.1 IC13.11(E:I) RESISTOR3.2
Unconnected: IC13.12(F:O)

### Notes on the sheet
- Project: CMOS Synthesizer Board
  Author: Lorenz Schwarz
- Schmitt trigger oscillators 9-12 and clock (CD40106)
- VERSION 2 | B
- 2024-05-15

## Sheet 10 of 12: Pseudo random number generator (CD4094, CD4070)
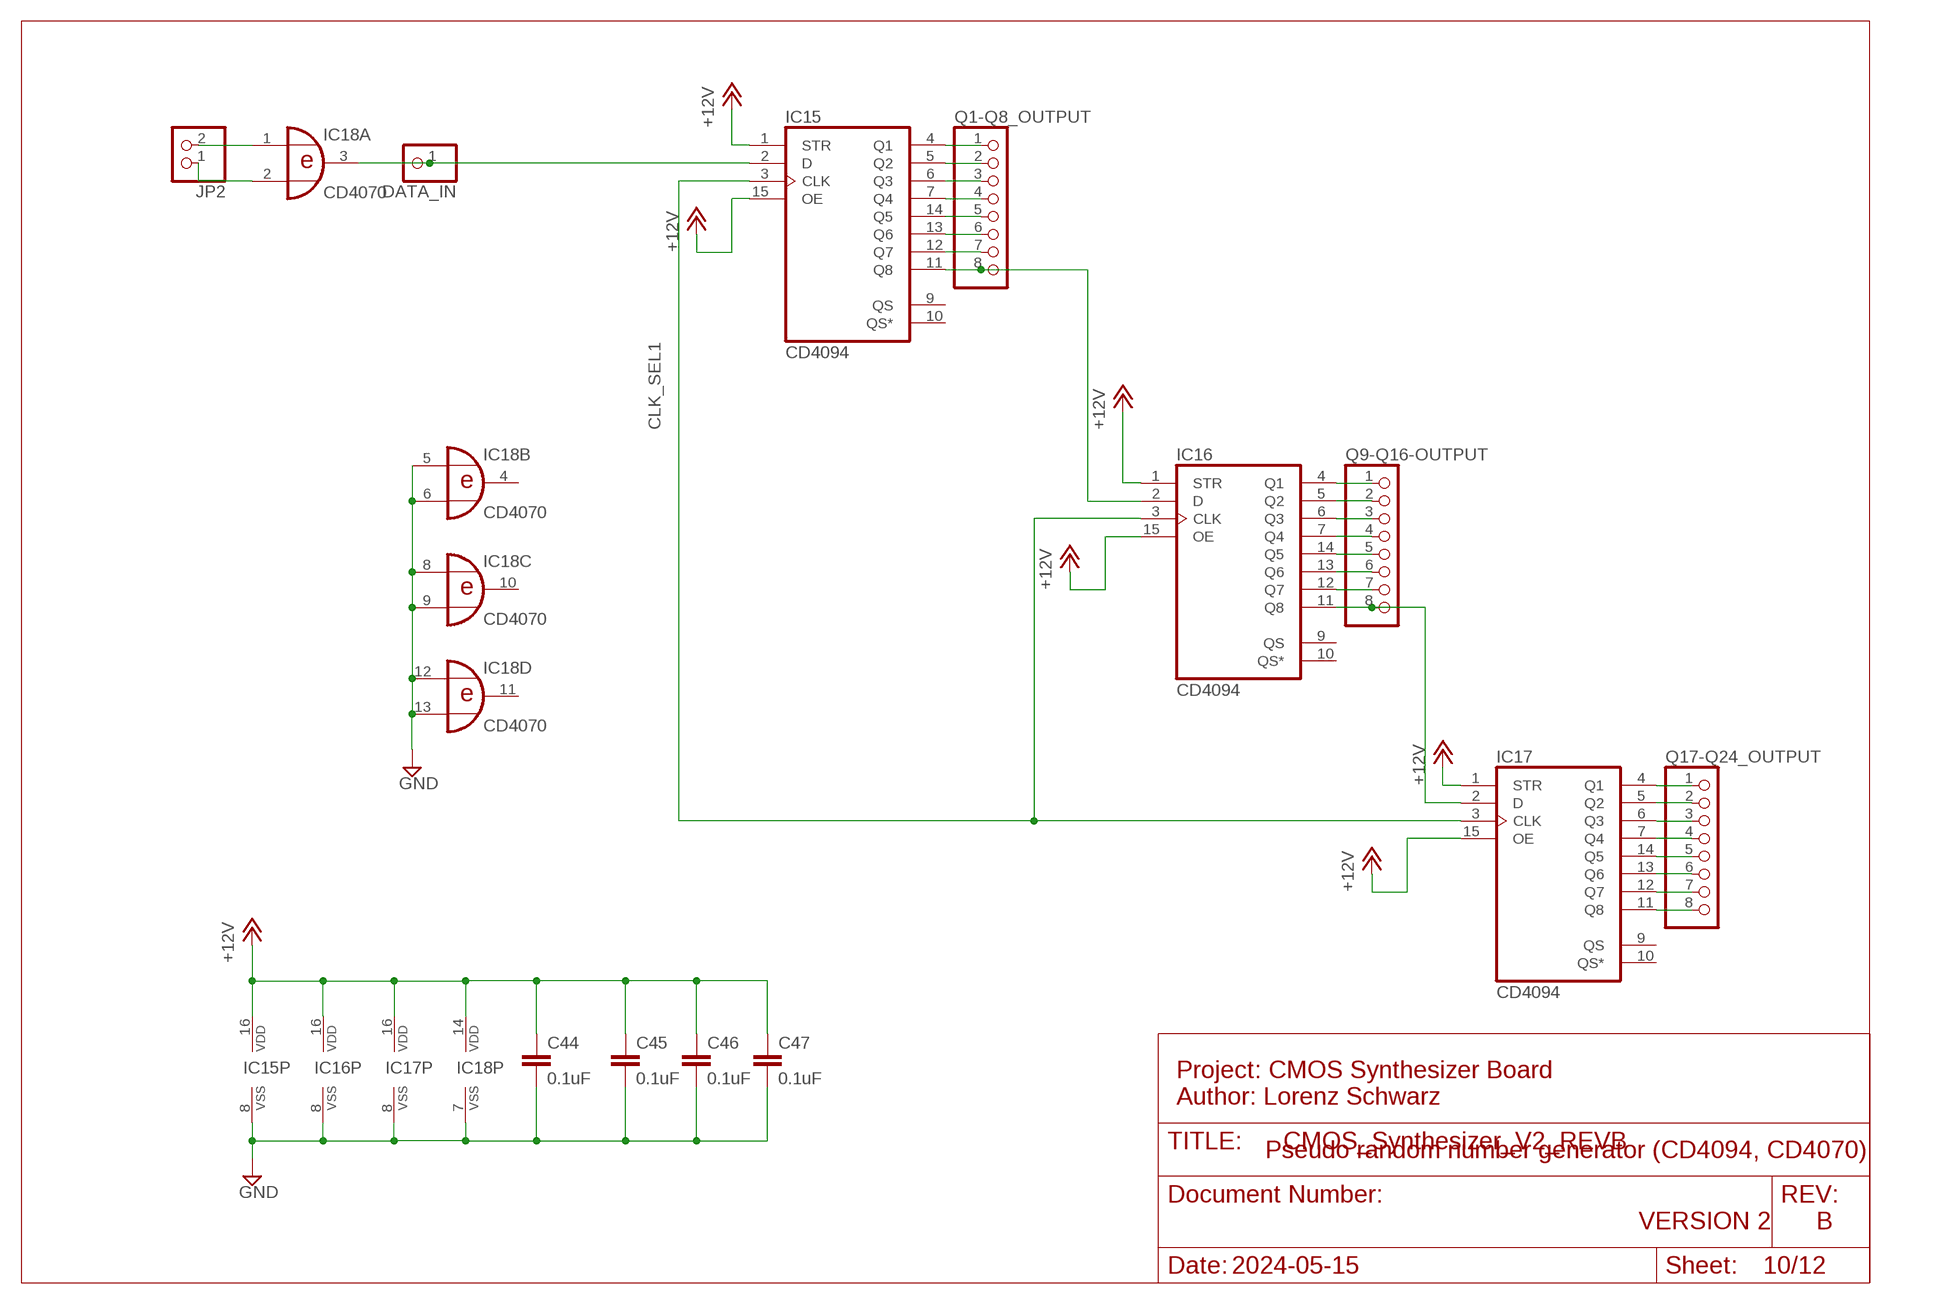
[diagram p9: schematic, sheet 10]

### Parts
C44  0.1uF  C-EUC0805  [C0805]
C45  0.1uF  C-EUC0805  [C0805]
C46  0.1uF  C-EUC0805  [C0805]
C47  0.1uF  C-EUC0805  [C0805]
DATA_IN  PINHD-1X1  [1X01]
IC15  CD4094  4094N  [DIL16]
IC16  CD4094  4094N  [DIL16]
IC17  CD4094  4094N  [DIL16]
IC18  CD4070  4070N  [DIL14]
JP2  PINHD-1X2  [1X02]
Q1-Q8_OUTPUT  PINHD-1X8  [1X08]
Q9-Q16-OUTPUT  PINHD-1X8  [1X08]
Q17-Q24_OUTPUT  PINHD-1X8  [1X08]

### Nets
+12V: C44.1 C45.1 C46.1 C47.1 IC15.1(STR) IC15.15(OE) IC15.16(VDD) IC16.1(STR) IC16.15(OE) IC16.16(VDD) IC17.1(STR) IC17.15(OE) IC17.16(VDD) IC18.14(P:VDD) ; also sheet 1,2,3,4,5,6,7,8,9,11
CLK_SEL1: IC15.3(CLK) IC16.3(CLK) IC17.3(CLK) ; also sheet 5,12
GND: C44.2 C45.2 C46.2 C47.2 IC15.8(VSS) IC16.8(VSS) IC17.8(VSS) IC18.5(B:I0) IC18.6(B:I1) IC18.7(P:VSS) IC18.8(C:I0) IC18.9(C:I1) IC18.12(D:I0) IC18.13(D:I1) ; also sheet 1,2,3,4,5,6,7,8,9,11,12
N$162: IC15.11(Q8) IC16.2(D) Q1-Q8_OUTPUT.8
N$164: IC16.11(Q8) IC17.2(D) Q9-Q16-OUTPUT.8
N$165: IC17.11(Q8) Q17-Q24_OUTPUT.8
N$169: DATA_IN.1 IC15.2(D) IC18.3(A:O)
N$170: IC15.12(Q7) Q1-Q8_OUTPUT.7
N$171: IC15.13(Q6) Q1-Q8_OUTPUT.6
N$172: IC15.14(Q5) Q1-Q8_OUTPUT.5
N$173: IC15.7(Q4) Q1-Q8_OUTPUT.4
N$174: IC15.6(Q3) Q1-Q8_OUTPUT.3
N$175: IC15.5(Q2) Q1-Q8_OUTPUT.2
N$176: IC15.4(Q1) Q1-Q8_OUTPUT.1
N$177: IC16.4(Q1) Q9-Q16-OUTPUT.1
N$178: IC16.5(Q2) Q9-Q16-OUTPUT.2
N$179: IC16.6(Q3) Q9-Q16-OUTPUT.3
N$180: IC16.7(Q4) Q9-Q16-OUTPUT.4
N$181: IC16.14(Q5) Q9-Q16-OUTPUT.5
N$182: IC16.13(Q6) Q9-Q16-OUTPUT.6
N$183: IC16.12(Q7) Q9-Q16-OUTPUT.7
N$184: IC17.4(Q1) Q17-Q24_OUTPUT.1
N$185: IC17.5(Q2) Q17-Q24_OUTPUT.2
N$186: IC17.6(Q3) Q17-Q24_OUTPUT.3
N$187: IC17.7(Q4) Q17-Q24_OUTPUT.4
N$188: IC17.14(Q5) Q17-Q24_OUTPUT.5
N$189: IC17.13(Q6) Q17-Q24_OUTPUT.6
N$190: IC17.12(Q7) Q17-Q24_OUTPUT.7
N$191: IC18.1(A:I0) JP2.2
N$192: IC18.2(A:I1) JP2.1
Unconnected: IC15.9(QS) IC15.10(QS*) IC16.9(QS) IC16.10(QS*) IC17.9(QS) IC17.10(QS*) IC18.4(B:O) IC18.10(C:O) IC18.11(D:O)

### Notes on the sheet
- Project: CMOS Synthesizer Board
  Author: Lorenz Schwarz
- Pseudo random number generator (CD4094, CD4070)
- VERSION 2 | B
- 2024-05-15

## Sheet 11 of 12: Mixing section (LM358)
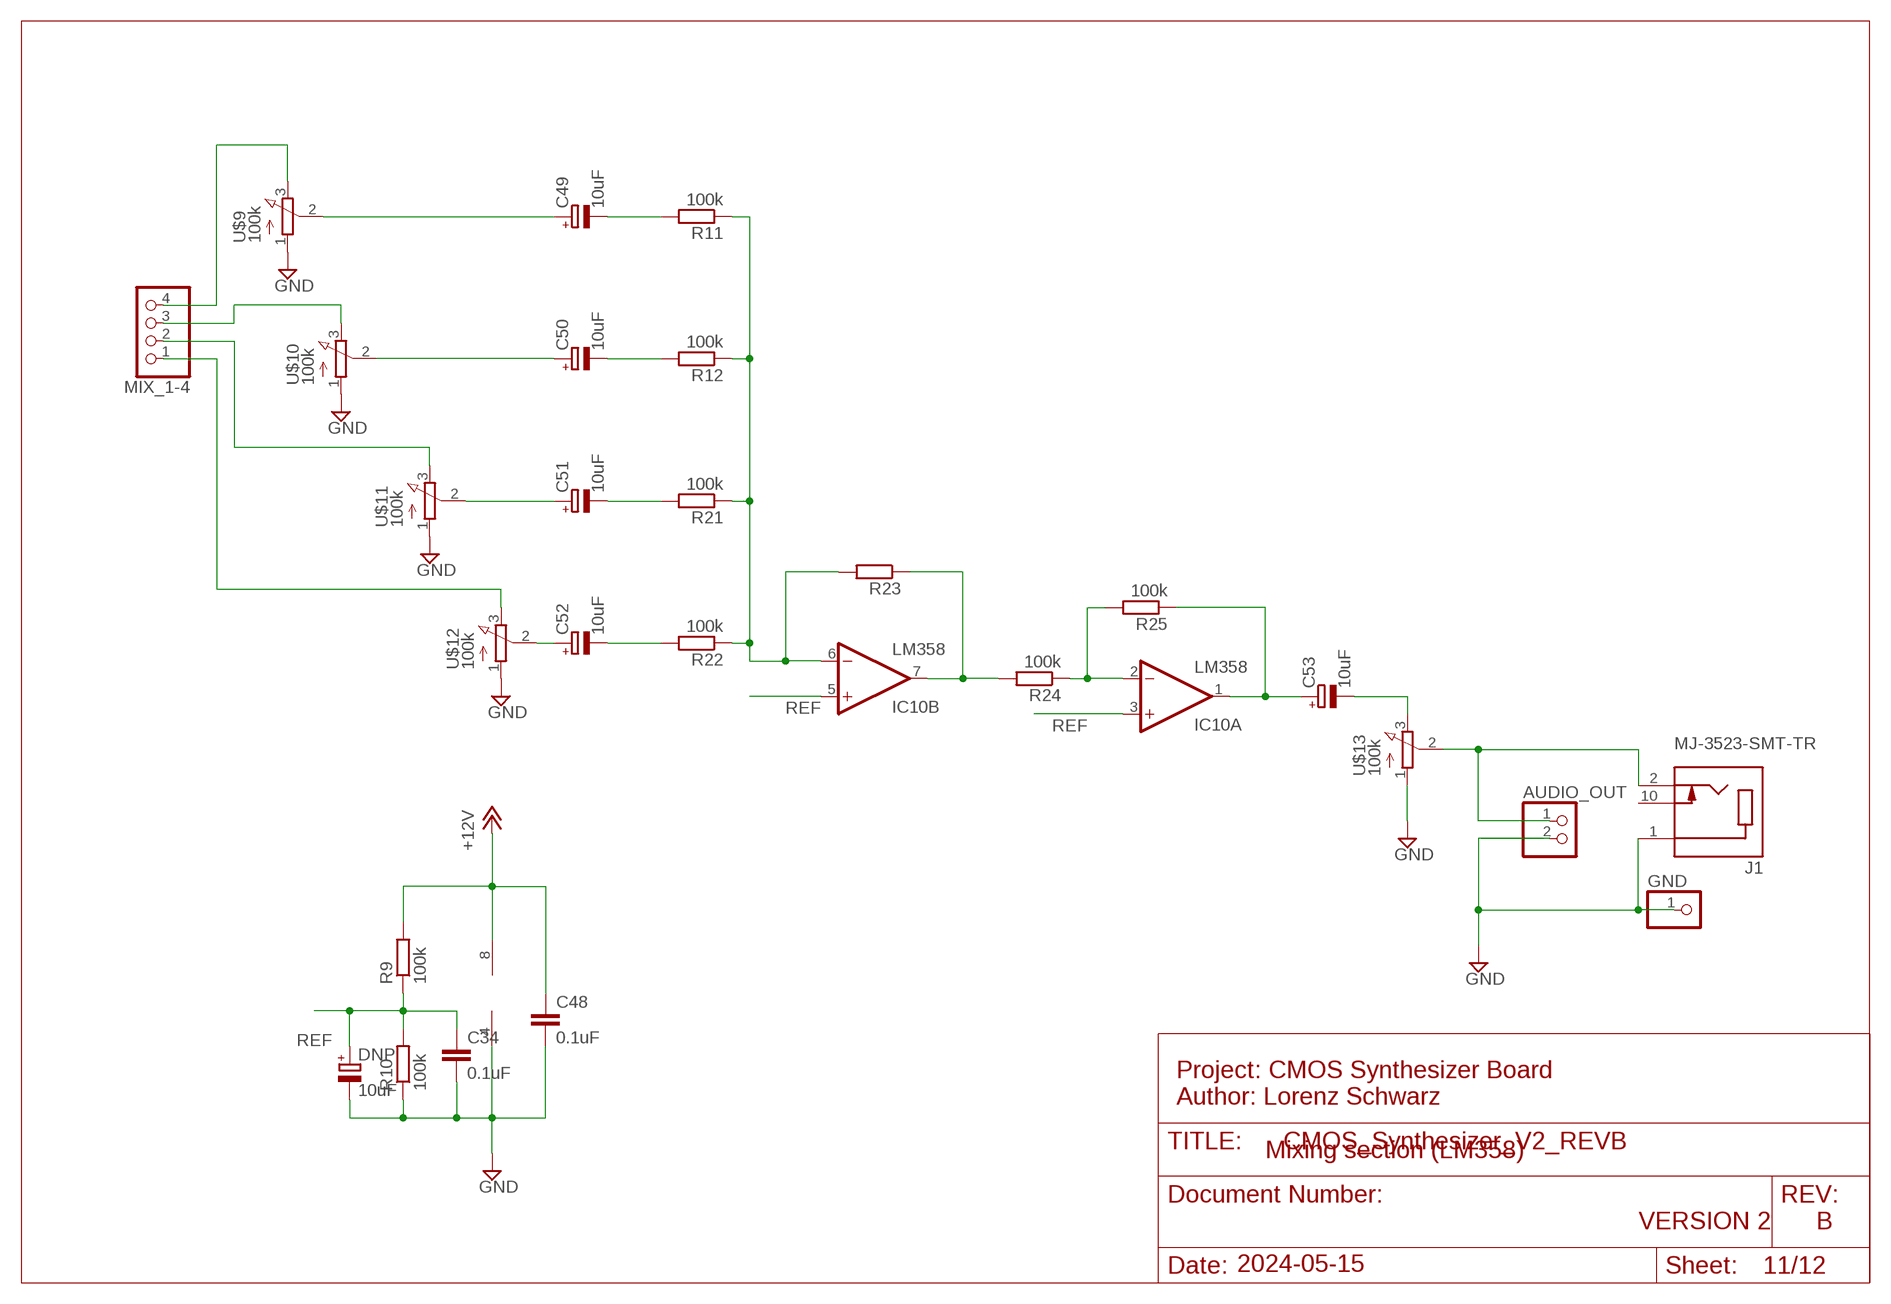
[diagram p10: schematic, sheet 11]

### Parts
AUDIO_OUT  PINHD-1X2  [1X02]
C34  0.1uF  C-EUC0805  [C0805]
C48  0.1uF  C-EUC0805  [C0805]
C49  10uF  CPOL-EUD  [PANASONIC_D]
C50  10uF  CPOL-EUD  [PANASONIC_D]
C51  10uF  CPOL-EUD  [PANASONIC_D]
C52  10uF  CPOL-EUD  [PANASONIC_D]
C53  10uF  CPOL-EUD  [PANASONIC_D]
DNP  10uF  CPOL-EUD  [PANASONIC_D]
GND  PINHD-1X1  [1X01]
IC10  LM358  LM358N  [DIL08]
J1  MJ-3523-SMT-TR  [CUI_MJ-3523-SMT-TR]
MIX_1-4  PINHD-1X4  [1X04]
R9  100k  R-EU_R0805  [R0805]
R10  100k  R-EU_R0805  [R0805]
R11  100k  R-EU_R0805  [R0805]
R12  100k  R-EU_R0805  [R0805]
R21  100k  R-EU_R0805  [R0805]
R22  100k  R-EU_R0805  [R0805]
R23  R-EU_R0805  [R0805]
R24  100k  R-EU_R0805  [R0805]
R25  100k  R-EU_R0805  [R0805]
U$9  100k  POT_VERTICAL  [POT_VER]
U$10  100k  POT_VERTICAL  [POT_VER]
U$11  100k  POT_VERTICAL  [POT_VER]
U$12  100k  POT_VERTICAL  [POT_VER]
U$13  100k  POT_VERTICAL  [POT_VER]

### Nets
+12V: C48.1 IC10.8(P:V+) R9.2 ; also sheet 1,2,3,4,5,6,7,8,9,10
GND: AUDIO_OUT.2 C34.2 C48.2 DNP.- GND.1 IC10.4(P:V-) J1.1 R10.1 U$9.1(A) U$10.1(A) U$11.1(A) U$12.1(A) U$13.1(A) ; also sheet 1,2,3,4,5,6,7,8,9,10,12
N$111: C49.+ U$9.2(S)
N$112: C50.+ U$10.2(S)
N$113: IC10.6(B:-IN) R11.1 R12.1 R21.1 R22.1 R23.2
N$114: IC10.2(A:-IN) R24.1 R25.2
N$115: IC10.7(B:OUT) R23.1 R24.2
N$116: C53.+ IC10.1(A:OUT) R25.1
N$117: C51.+ U$11.2(S)
N$118: C52.+ U$12.2(S)
N$193: C52.- R22.2
N$194: C51.- R21.2
N$195: C50.- R12.2
N$196: C49.- R11.2
N$197: MIX_1-4.4 U$9.3(E)
N$198: MIX_1-4.3 U$10.3(E)
N$199: MIX_1-4.2 U$11.3(E)
N$200: MIX_1-4.1 U$12.3(E)
N$201: C53.- U$13.3(E)
N$202: AUDIO_OUT.1 J1.2 U$13.2(S)
REF: C34.1 DNP.+ IC10.3(A:+IN) IC10.5(B:+IN) R9.1 R10.2
Unconnected: J1.10

### Notes on the sheet
- Project: CMOS Synthesizer Board
  Author: Lorenz Schwarz
- Mixing section (LM358)
- VERSION 2 | B
- 2024-05-15

## Sheet 12 of 12: Rotary Switches "1 of 8"
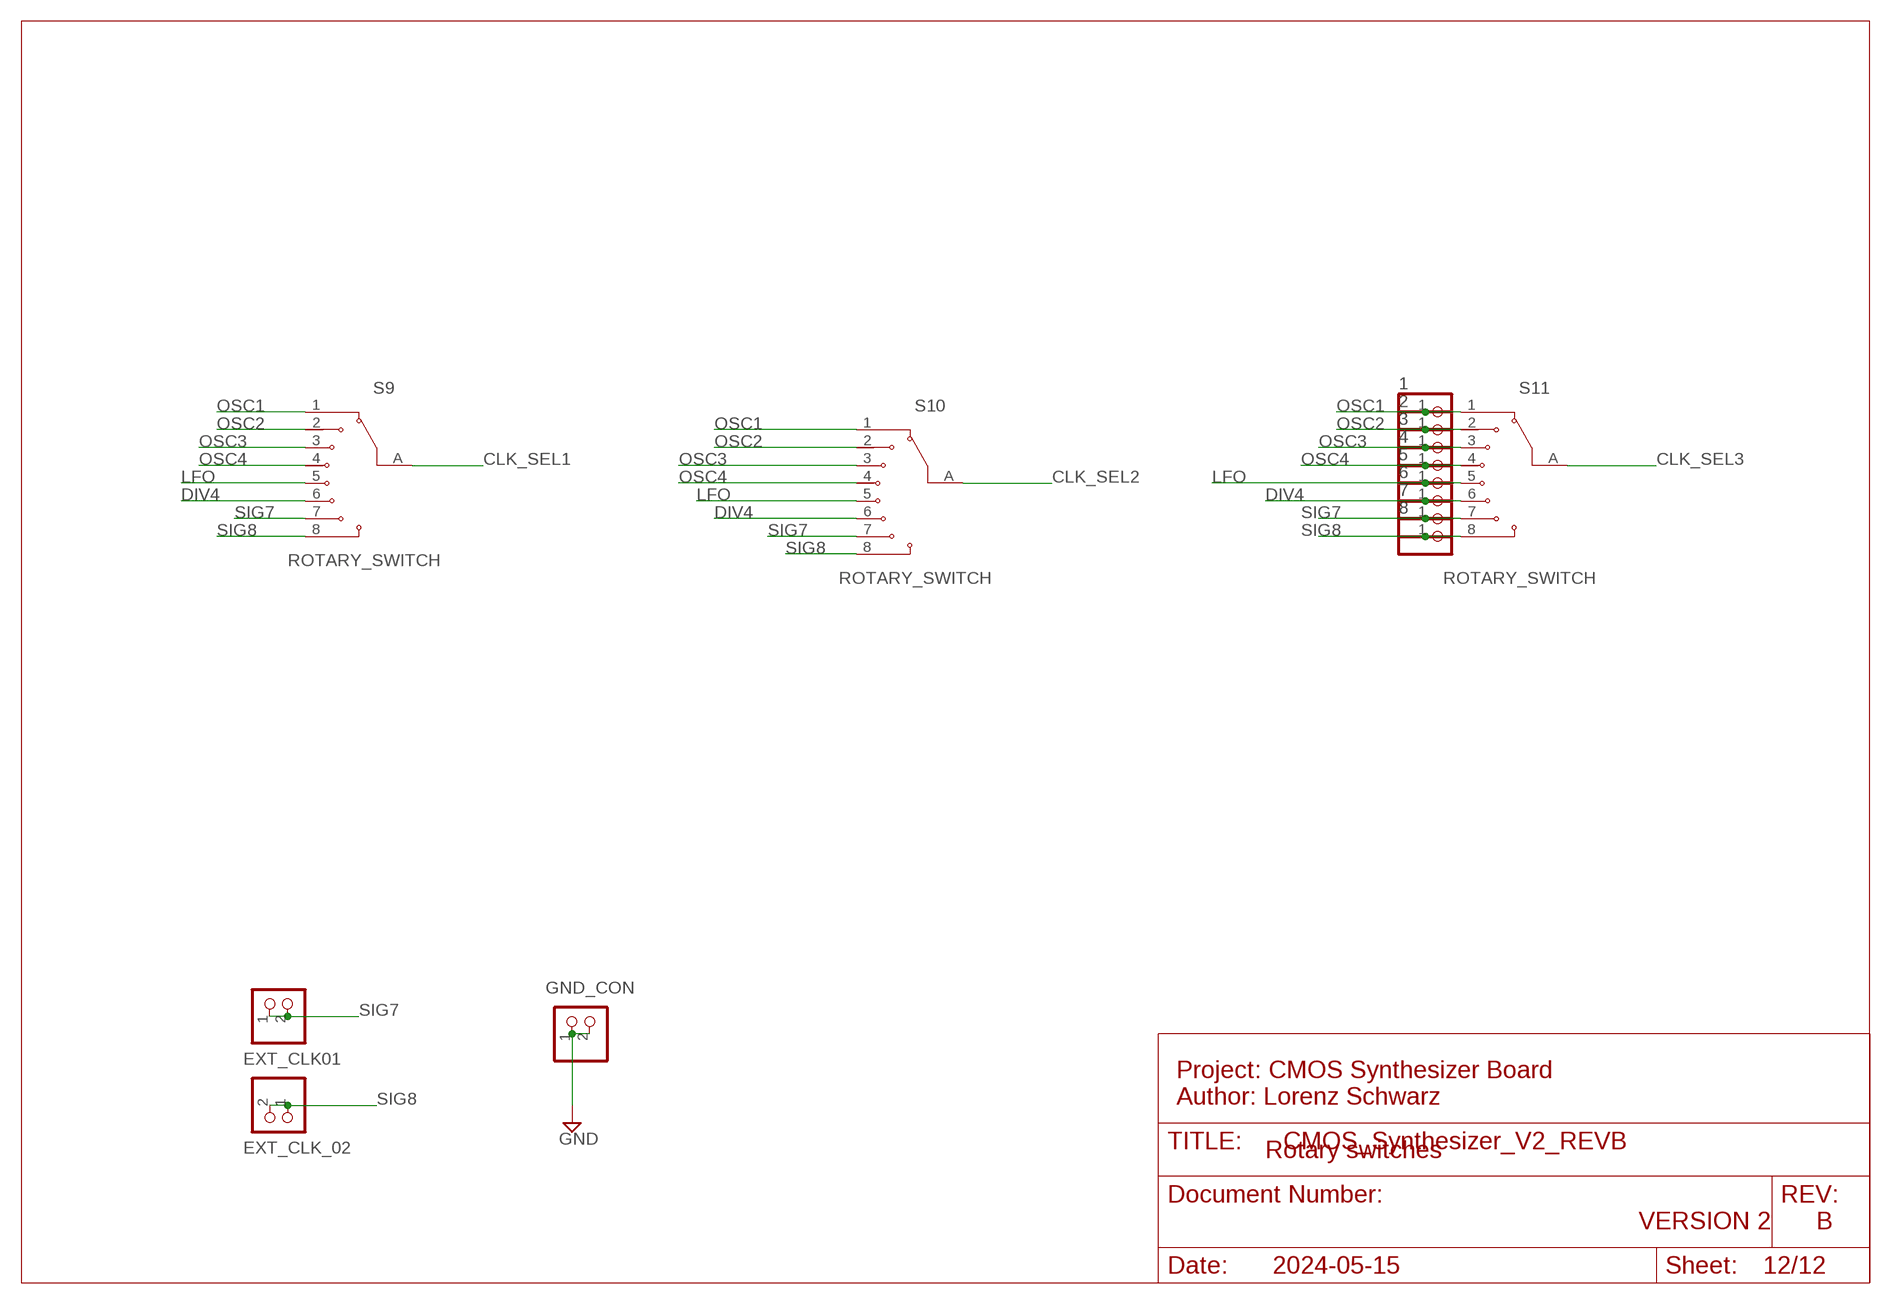
[diagram p11: schematic, sheet 12]

### Parts
1  PINHD-1X1  [1X01]
2  PINHD-1X1  [1X01]
3  PINHD-1X1  [1X01]
4  PINHD-1X1  [1X01]
5  PINHD-1X1  [1X01]
6  PINHD-1X1  [1X01]
7  PINHD-1X1  [1X01]
8  PINHD-1X1  [1X01]
EXT_CLK01  PINHD-1X2  [1X02]
EXT_CLK_02  PINHD-1X2  [1X02]
GND_CON  PINHD-1X2  [1X02]
S9  ROTARY_SWITCH  [ROTARY]
S10  ROTARY_SWITCH  [ROTARY]
S11  ROTARY_SWITCH  [ROTARY]

### Nets
CLK_SEL1: S9.A ; also sheet 5,10
CLK_SEL2: S10.A ; also sheet 7
CLK_SEL3: S11.A ; also sheet 8
DIV4: 6.1 S9.6 S10.6 S11.6 ; also sheet 5
GND: GND_CON.1 GND_CON.2 ; also sheet 1,2,3,4,5,6,7,8,9,10,11
LFO: 5.1 S9.5 S10.5 S11.5 ; also sheet 9
OSC1: 1.1 S9.1 S10.1 S11.1 ; also sheet 1
OSC2: 2.1 S9.2 S10.2 S11.2 ; also sheet 1
OSC3: 3.1 S9.3 S10.3 S11.3 ; also sheet 1
OSC4: 4.1 S9.4 S10.4 S11.4 ; also sheet 1
SIG7: 7.1 EXT_CLK01.1 EXT_CLK01.2 S9.7 S10.7 S11.7
SIG8: 8.1 EXT_CLK_02.1 EXT_CLK_02.2 S9.8 S10.8 S11.8

### Notes on the sheet
- Project: CMOS Synthesizer Board
  Author: Lorenz Schwarz
- Rotary switches
- VERSION 2 | B
- 2024-05-15

## Library data of the parts
1-8 12V CLK CLK_IN_4018 CLR CO_4022 DATA_IN DIVIDE_ODD_OUTPUT GND IN_1 IN_4040 INH_1 INH_51 INH_53 JP1 JP5-JP7 RES RES_1 RES_4040 X0_ X1_ Y0_ Y1_ Z0 Z1 = pinhead01:PINHD-1X1: PIN HEADER
4070_IN1-4070_IN4 4070_OUT 4070_OUT1-4070_OUT3 GATE_IN_1-4 GATE_IN_4-8 OSC_OUT OSC_OUT1-OSC_OUT3 X0123_1 X0123_51 X4567_1 X4567_51 = pinhead-1:PINHD-1X4: PIN HEADER
ABC_1 ABC_51 ABC_53 = pinhead_mod:PINHD-1X3: PIN HEADER
AUDIO_OUT CLK_OUT EXT_CLK01 EXT_CLK_02 GND_CON IN_4011 JP2 RESISTOR1-RESISTOR4 X XOUT XOUT1 Y Z = pinhead01:PINHD-1X2: PIN HEADER
C1-C7 C12 C13 C23 C49-C53 DNP = rcl:CPOL-EU: POLARIZED CAPACITOR, European symbol; SPICEPREFIX: C
C8-C11 C14-C22 C24-C29 C31-C41 C43-C48 = rcl:C-EU: CAPACITOR, European symbol; SPICEPREFIX: C
D1 = MBRS140:MBRS140: MBRS140 Series 1 A 40 V SMD Schottky Barrier Rectifier - DO-214AA; AVAILABILITY: Unavailable; DESCRIPTION: Diode Schottky 40V 1A Surface Mount SMB _DO-214AA_; MF: ON; MP: MBRS140; PACKAGE: DO-214 Fairchild Semiconductor; PRICE: None
HIGH1 HIGH(1) LOW1 LOW(0) MIX_1-4 = pinhead_mod:PINHD-1X4: PIN HEADER
IC1 IC3 = 40xx_edit:4093: Quad 2-input NAND schmitt trigger
IC2 IC5 = 40xx_FP_mod:4051: 8-channel ANALOG MULTIPLEXER
IC4 IC14 IC18 = 40xx_edit:4070: Quad 2-input XOR
IC6 IC8 = 40xx_edit:4024: 7-stage binary/ripple COUNTER
IC7 = 40xx_edit:4053: Triple 2-channel ANALOG MULTIPLEXER
IC9 = 40xx_edit:4022: Divide-by 8 COUNTER
IC10 = linear:LM358: OP AMP also LM158; LM258; LM2904 Source: http://cache.national.com/ds/LM/LM158.pdf
IC11 = 40xx_edit:4018: COUNTER/DIVIDER
IC12 = 40xx_edit:4011: Quad 2-input NAND
IC13 = 40xx_edit:40106: Hex SCHMITT TRIGGER
IC15-IC17 = 40xx_FP_mod:4094: 8-stage SHIFT/STORE REGISTER, tri-state
J1 = MJ-3523-SMT-TR:MJ-3523-SMT-TR: Check availability <https://pricing.snapeda.com/parts/MJ-3523-SMT-TR/CUI%20Devices/view-part?ref=eda>; AVAILABILITY: In Stock; CHECK_PRICES: https://www.snapeda.com/parts/MJ-3523-SMT-TR/CUI+Devices/view-part/?ref=eda; CUI_PURCHASE_URL: https://www.cuidevices.com/product/interconnect/connectors/audio-connectors/jacks/mj-3523-smt-tr?utm_source=snapeda.com&utm_medium=referral&utm_campaign=snapedaBOM; DESCRIPTION: 3.5 mm, Mono, Right Angle, Surface Mount (SMT), 2 Conductors, 1 Internal Switch, Audio Jack Connector; MF: CUI Devices; MP: MJ-3523-SMT-TR; PACKAGE: None; PRICE: None; SNAPEDA_LINK: https://www.snapeda.com/parts/MJ-3523-SMT-TR/CUI+Devices/view-part/?ref=snap
JP4 = pinhead-1:PINHD-1X2: PIN HEADER
JP8 JP9 = pinhead_mod:PINHD-1X7: PIN HEADER
LED = OPL_Optoelectronics:DIP-LED-GREEN-GREEN(2P-D3MM): 304090040; MPN: CX-G302DC
P1-P8 = sol_pin:MOUNT_CH: mounting hole 3,2 mm M3
Q0-Q7 = pinhead-1:PINHD-1X8: PIN HEADER
Q1-Q5 = pinhead01:PINHD-1X5: PIN HEADER
Q1-Q8_OUTPUT Q9-Q16-OUTPUT Q17-Q24_OUTPUT = pinhead01:PINHD-1X8: PIN HEADER
R1-R25 R27 = rcl:R-EU_: RESISTOR, European symbol; SPICEPREFIX: R
S1-S8 = switch_mod:M9040P: TOGGLE SWITCH Marquardt
S9-S11 = SP8T_Rotary:ROTARY_SWITCH: Check availability <https://pricing.snapeda.com/parts/KC15A9.501NPF/E-Switch/view-part?ref=eda>
S12 S13 = 5-1437565-0:5-1437565-0: Switch Tactile OFF (ON) Round Button Gull Wing 0.05A 12VDC 1.57N SMD T/R Check availability <https://pricing.snapeda.com/parts/FSM6JSMATR/TE%20Connectivity/view-part?ref=eda>; AVAILABILITY: In Stock; COMMENT: 5-1437565-0; DESCRIPTION: Switch Push Button N.O. SPST Round Button 0.05A 12VDC 1VA Alternate Contact Gull Wing SMD T/R; MF: TE Connectivity; MP: FSM6JSMATR; PACKAGE: None; PRICE: None; PURCHASE-URL: https://pricing.snapeda.com/search/part/FSM6JSMATR/?ref=eda
U$1-U$14 = Pot_Vertical:POT_VERTICAL